# Altium project PT-15-V1.0.PrjPcb (part 4 of 7)

## Sheet 06-RTL8111H-1.schdoc
size A2
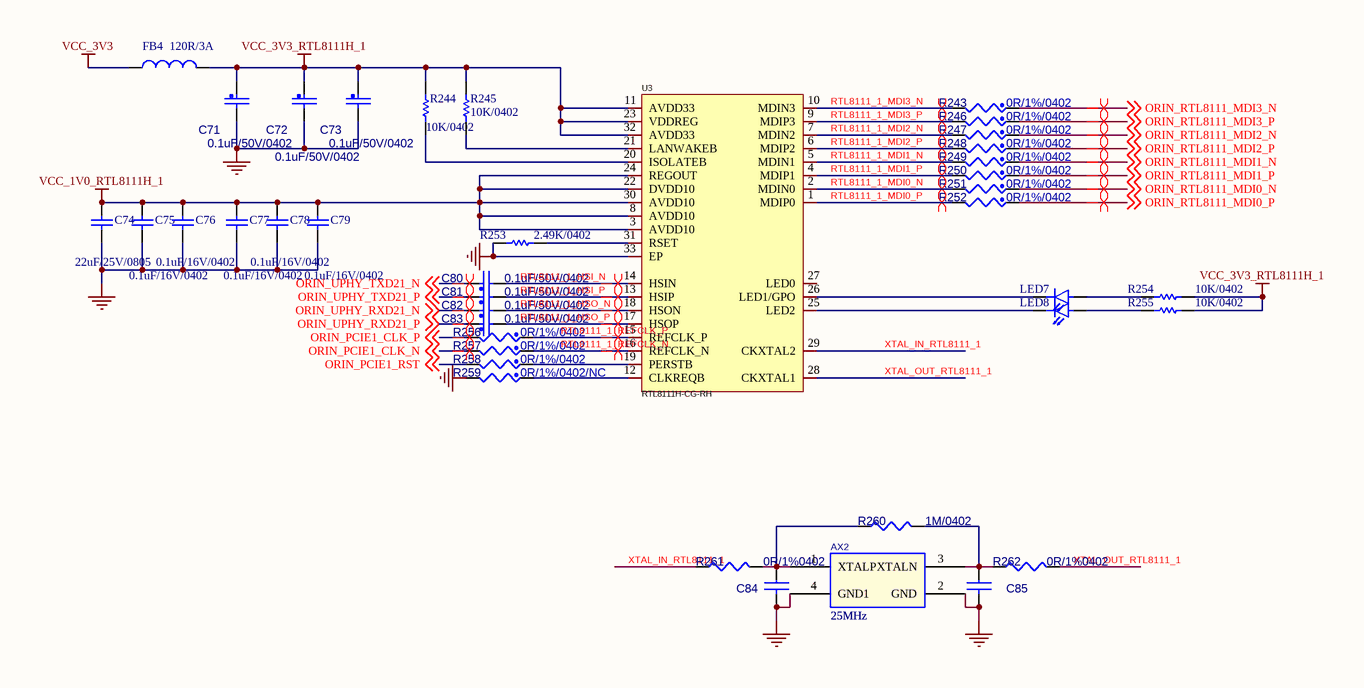
[diagram p9: 06-RTL8111H-1.schdoc]

### Parts
AX2  25MHz  [2016]
C71  value 0.1uF/50V/0402  [C0402]  (hidden comment: CAP_NP)
C72  value 0.1uF/50V/0402  [C0402]  (hidden comment: CAP_NP)
C73  value 0.1uF/50V/0402  [C0402]  (hidden comment: CAP_NP)
C74  22uF/25V/0805  [C0805]
C75  0.1uF/16V/0402  [C0402]
C76  0.1uF/16V/0402  [C0402]
C77  0.1uF/16V/0402  [C0402]
C78  0.1uF/16V/0402  [C0402]
C79  0.1uF/16V/0402  [C0402]
C80  value 0.1uF/50V/0402  [C0402]  (hidden comment: CAP_NP)
C81  value 0.1uF/50V/0402  [C0402]  (hidden comment: CAP_NP)
C82  value 0.1uF/50V/0402  [C0402]  (hidden comment: CAP_NP)
C83  value 0.1uF/50V/0402  [C0402]  (hidden comment: CAP_NP)
C84  CAP NP_Dup3  [C0402]  (value not drawn)
C85  CAP NP_Dup3  [C0402]  (value not drawn)
FB4  120R/3A  [L0603]
LED7  LED_GREEN  [LED0603]  (value not drawn)
LED8  LED_GREEN  [LED0603]  (value not drawn)
R243  value 0R/1%/0402  [R0402]  (hidden comment: RES_Dup2)
R244  10K/0402  [R0402]
R245  10K/0402  [R0402]
R246  value 0R/1%/0402  [R0402]  (hidden comment: RES_Dup2)
R247  value 0R/1%/0402  [R0402]  (hidden comment: RES_Dup2)
R248  value 0R/1%/0402  [R0402]  (hidden comment: RES_Dup2)
R249  value 0R/1%/0402  [R0402]  (hidden comment: RES_Dup2)
R250  value 0R/1%/0402  [R0402]  (hidden comment: RES_Dup2)
R251  value 0R/1%/0402  [R0402]  (hidden comment: RES_Dup2)
R252  value 0R/1%/0402  [R0402]  (hidden comment: RES_Dup2)
R253  2.49K/0402  [R0402]
R254  10K/0402  [R0402]
R255  10K/0402  [R0402]
R256  value 0R/1%/0402  [R0402]  (hidden comment: RES_Dup2)
R257  value 0R/1%/0402  [R0402]  (hidden comment: RES_Dup2)
R258  value 0R/1%/0402  [R0402]  (hidden comment: RES_Dup2)
R259  value 0R/1%/0402/NC  [R0402]  (hidden comment: RES_Dup2)
R260  value 1M/0402  [R0402]  (hidden comment: R_Dup3)
R261  value 0R/1%0402  [R0402]  (hidden comment: R_Dup3)
R262  value 0R/1%0402  [R0402]  (hidden comment: R_Dup3)
U3  RTL8111H-CG-RH  [RTL8111H-CG-RH]

### Nets
GND: AX2.2(GND) AX2.4(GND1) C71.2 C72.2 C73.2 C74.1 C75.1 C76.1 C77.1 C78.1 C79.1 C84.2 C85.2 R253.1 R259.2 U3.33(EP)
VCC_1V0_RTL8111H_1: C74.2 C75.2 C76.2 C77.2 C78.2 C79.2 U3.3(AVDD10) U3.8(AVDD10) U3.22(DVDD10) U3.24(REGOUT) U3.30(AVDD10)
VCC_3V3: FB4.1  [project net 3V3_ORIN_F1]
VCC_3V3_RTL8111H_1: C71.1 C72.1 C73.1 FB4.2 R244.1 R245.1 R254.1 R255.1 U3.11(AVDD33) U3.23(VDDREG) U3.32(AVDD33)
ORIN_PCIE1_CLK_N: R257.2 ; off-sheet ORIN_PCIE1_CLK_N  [project net DP1_TXD2_N]
ORIN_PCIE1_CLK_P: R256.2 ; off-sheet ORIN_PCIE1_CLK_P  [project net DP1_TXD2_P]
ORIN_PCIE1_RST: R258.2 ; off-sheet ORIN_PCIE1_RST  [project net SNN_NVHS_SLVS_RX5_N]
ORIN_RTL8111_MDI0_N: R251.1 ; off-sheet ORIN_RTL8111_MDI0_N
ORIN_RTL8111_MDI0_P: R252.1 ; off-sheet ORIN_RTL8111_MDI0_P
ORIN_RTL8111_MDI1_N: R249.1 ; off-sheet ORIN_RTL8111_MDI1_N
ORIN_RTL8111_MDI1_P: R250.1 ; off-sheet ORIN_RTL8111_MDI1_P
ORIN_RTL8111_MDI2_N: R247.1 ; off-sheet ORIN_RTL8111_MDI2_N
ORIN_RTL8111_MDI2_P: R248.1 ; off-sheet ORIN_RTL8111_MDI2_P
ORIN_RTL8111_MDI3_N: R243.1 ; off-sheet ORIN_RTL8111_MDI3_N
ORIN_RTL8111_MDI3_P: R246.1 ; off-sheet ORIN_RTL8111_MDI3_P
ORIN_UPHY_RXD21_N: C82.1 ; off-sheet ORIN_UPHY_RXD21_N  [project net SNN_NVHS_SLVS_RX1_N]
ORIN_UPHY_RXD21_P: C83.1 ; off-sheet ORIN_UPHY_RXD21_P  [project net SNN_NVHS_SLVS_RX1_P]
ORIN_UPHY_TXD21_N: C80.1 ; off-sheet ORIN_UPHY_TXD21_N  [project net SNN_NVHS1_TX1_N]
ORIN_UPHY_TXD21_P: C81.1 ; off-sheet ORIN_UPHY_TXD21_P  [project net SNN_NVHS1_TX1_P]
RTL8111_1_HSI_N: C80.2 U3.14(HSIN)
RTL8111_1_HSI_P: C81.2 U3.13(HSIP)
RTL8111_1_HSO_N: C82.2 U3.18(HSON)
RTL8111_1_HSO_P: C83.2 U3.17(HSOP)
RTL8111_1_MDI0_N: R251.2 U3.2(MDIN0)
RTL8111_1_MDI0_P: R252.2 U3.1(MDIP0)
RTL8111_1_MDI1_N: R249.2 U3.5(MDIN1)
RTL8111_1_MDI1_P: R250.2 U3.4(MDIP1)
RTL8111_1_MDI2_N: R247.2 U3.7(MDIN2)
RTL8111_1_MDI2_P: R248.2 U3.6(MDIP2)
RTL8111_1_MDI3_N: R243.2 U3.10(MDIN3)
RTL8111_1_MDI3_P: R246.2 U3.9(MDIP3)
RTL8111_1_REFCLK_N: R257.1 U3.16(REFCLK_N)
RTL8111_1_REFCLK_P: R256.1 U3.15(REFCLK_P)
XTAL_IN_RTL8111_1: R261.1 U3.29(CKXTAL2)
XTAL_OUT_RTL8111_1: R262.2 U3.28(CKXTAL1)
NetAX2_1: AX2.1(XTALP) C84.1 R260.1 R261.2
NetAX2_3: AX2.3(XTALN) C85.1 R260.2 R262.1
NetLED7_1: LED7.1 R254.2
NetLED7_2: LED7.2 U3.26(LED1/GPO)
NetLED8_1: LED8.1 R255.2
NetLED8_2: LED8.2 U3.25(LED2)
NetR244_2: R244.2 U3.20(ISOLATEB)
NetR245_2: R245.2 U3.21(LANWAKEB)
NetR253_2: R253.2 U3.31(RSET)
NetR258_1: R258.1 U3.19(PERSTB)
NetR259_1: R259.1 U3.12(CLKREQB)

Not connected (* = marked no-connect by the designer): U3 27(LED0)

### Layout directives
differential pair: DP1_TXD2_N, DP1_TXD2_P, ORIN_RTL8111_MDI0_N, ORIN_RTL8111_MDI0_P, ORIN_RTL8111_MDI1_N, ORIN_RTL8111_MDI1_P, ORIN_RTL8111_MDI2_N, ORIN_RTL8111_MDI2_P, ORIN_RTL8111_MDI3_N, ORIN_RTL8111_MDI3_P, RTL8111_1_HSI_N, RTL8111_1_HSI_P, RTL8111_1_HSO_N, RTL8111_1_HSO_P, RTL8111_1_MDI0_N, RTL8111_1_MDI0_P, RTL8111_1_MDI1_N, RTL8111_1_MDI1_P, RTL8111_1_MDI2_N, RTL8111_1_MDI2_P, RTL8111_1_MDI3_N, RTL8111_1_MDI3_P, RTL8111_1_REFCLK_N, RTL8111_1_REFCLK_P, SNN_NVHS1_TX1_N, SNN_NVHS1_TX1_P, SNN_NVHS_SLVS_RX1_N, SNN_NVHS_SLVS_RX1_P

### Library data of the parts
AX2 = XTAL_0: as AX1 on sheet 05_RTL8211F; Value: 25MHz
C71-C73 C80-C83 = CAP_NP: GCM155R71H104KE02/MURATA; Part Reference: C15; CLASS: DISCRETE; FPLIST: CC0402_25,CC0402_HD,CC0402_CC; CAD_APPROVED: Yes; MFG_PN01: 0402YC104KAT2A; MFG_NAME01: AVX; Tolerance: 10%; AGILE_PN: 150-75182; VOLTAGE: 16V; HEIGHT: 0.635MM; ROHS: Yes; TOL: 10%; PCB Footprint: C0402
C74-C79 = CAP: Capacitor; Value: 100pF; Published: 8-Jun-2000; Revision: July-2002: Re-released for DXP Platform.; Publisher: Altium Limited
C84 = CAP NP_Dup3: Part Reference: C71; Value: 20pF/50V X7R; PCB Footprint: C0402
C85 = CAP NP_Dup3: Part Reference: C72; Value: 20pF/50V X7R; PCB Footprint: C0402
FB4 = Inductor: BLM18KG121TN1D; Code_IEC: 1005; Value: 10mH; Published: 8-Jun-2000; LatestRevisionDate: 29-May-2009; LatestRevisionNote: IPC-7351 Footprint Added.; PackageReference: 0402-A; Publisher: Altium Limited; PackageDescription: Chip Inductor; Code_JEITA: 0402
LED7 LED8 = LED
R243 R256 = RES_Dup2: as R207 on sheet 05_RTL8211F; ROHS: Yes; HEIGHT: 0.4MM; PCB Footprint: R0402
R244 R245 R253 = Res Semi: Semiconductor Resistor; Value: 240R; Published: 8-Jun-2000; LatestRevisionDate: 17-Jul-2002; LatestRevisionNote: Re-released for DXP Platform.; PackageReference: AXIAL-0.5; Publisher: Altium Limited; PackageDescription: Axial Device, Thru-Hole; 2 Leads; 0.5 in Pin Spacing
R246 R257-R259 = RES_Dup2: as R208 on sheet 05_RTL8211F; HEIGHT: 0.4MM; ROHS: Yes; PCB Footprint: R0402
R247 = RES_Dup2: AC0402FR-070RL/YAGEO; Part Reference: R99; CLASS: DISCRETE; TOL: 5%; AGILE_PN: 470-75790; Tolerance: 1%; MFG_NAME01: YAGEO; MFG_PN01: CR-02FL6---33R; CAD_APPROVED: Yes; FPLIST: RC0603_OV; SIGNAL_MODEL: DEFAULT_RESISTOR_33.000000OHM_2_1; HEIGHT: 0.4MM; ROHS: Yes; PCB Footprint: R0402
R248 = RES_Dup2: AC0402FR-070RL/YAGEO; Part Reference: R101; CLASS: DISCRETE; TOL: 5%; AGILE_PN: 470-75790; Tolerance: 1%; MFG_NAME01: YAGEO; MFG_PN01: CR-02FL6---33R; CAD_APPROVED: Yes; FPLIST: RC0603_OV; SIGNAL_MODEL: DEFAULT_RESISTOR_33.000000OHM_2_1; HEIGHT: 0.4MM; ROHS: Yes; PCB Footprint: R0402
R249 = RES_Dup2: AC0402FR-070RL/YAGEO; Part Reference: R102; CLASS: DISCRETE; TOL: 5%; AGILE_PN: 470-75790; Tolerance: 1%; MFG_NAME01: YAGEO; MFG_PN01: CR-02FL6---33R; CAD_APPROVED: Yes; FPLIST: RC0603_OV; SIGNAL_MODEL: DEFAULT_RESISTOR_33.000000OHM_2_1; HEIGHT: 0.4MM; ROHS: Yes; PCB Footprint: R0402
R250 = RES_Dup2: AC0402FR-070RL/YAGEO; Part Reference: R103; CLASS: DISCRETE; TOL: 5%; AGILE_PN: 470-75790; Tolerance: 1%; MFG_NAME01: YAGEO; MFG_PN01: CR-02FL6---33R; CAD_APPROVED: Yes; FPLIST: RC0603_OV; SIGNAL_MODEL: DEFAULT_RESISTOR_33.000000OHM_2_1; HEIGHT: 0.4MM; ROHS: Yes; PCB Footprint: R0402
R251 = RES_Dup2: AC0402FR-070RL/YAGEO; Part Reference: R104; CLASS: DISCRETE; TOL: 5%; AGILE_PN: 470-75790; Tolerance: 1%; MFG_NAME01: YAGEO; MFG_PN01: CR-02FL6---33R; CAD_APPROVED: Yes; FPLIST: RC0603_OV; SIGNAL_MODEL: DEFAULT_RESISTOR_33.000000OHM_2_1; HEIGHT: 0.4MM; ROHS: Yes; PCB Footprint: R0402
R252 = RES_Dup2: AC0402FR-070RL/YAGEO; Part Reference: R105; CLASS: DISCRETE; TOL: 5%; AGILE_PN: 470-75790; Tolerance: 1%; MFG_NAME01: YAGEO; MFG_PN01: CR-02FL6---33R; CAD_APPROVED: Yes; FPLIST: RC0603_OV; SIGNAL_MODEL: DEFAULT_RESISTOR_33.000000OHM_2_1; HEIGHT: 0.4MM; ROHS: Yes; PCB Footprint: R0402
R254 R255 = Res Semi: Semiconductor Resistor; Value: 1K; Published: 8-Jun-2000; LatestRevisionDate: 17-Jul-2002; LatestRevisionNote: Re-released for DXP Platform.; PackageReference: AXIAL-0.5; Publisher: Altium Limited; PackageDescription: Axial Device, Thru-Hole; 2 Leads; 0.5 in Pin Spacing
R260 R261 = R_Dup3: Part Reference: R130; PCB Footprint: R0402
R262 = R_Dup3: Part Reference: R131; PCB Footprint: R0402
U3 = RTL8111H-CG: Manufacturer: REALTEK(瑞昱); Add into BOM: yes; Symbol: RTL8111H-CG; Device: RTL8111H-CG; LCSC Part Name: RTL8111H-CG; Supplier Part: C2761340; Manufacturer Part: RTL8111H-CG; Supplier Footprint: QFN-32-EP(4x4); JLCPCB Part Class: Extended Part; Datasheet: https://atta.szlcsc.com/upload/public/pdf/source/20210810/FF05C5D46F518898BC2EC053E52D54B5.pdf; Supplier: LCSC; Convert to PCB: yes; Comment_1: RTL8111H-CG

## Sheet 07-N100.SchDoc: KARGOBOT-TBOX-V2.0
size 513 x 386 mm; Page Create Date: March  8, 1995; Page Number: 4; Page Size: C; Page Count: 81; RevCode: A; DsnPath: C:\Users\Administrator\Desktop\123\KARGOBOT-TCU-ORIN-V1.1.DSN; SchematicName: KARGOBT-TCU-ORIN-V1.1; PageName: N100; PageSize: C; TopSchematic: True
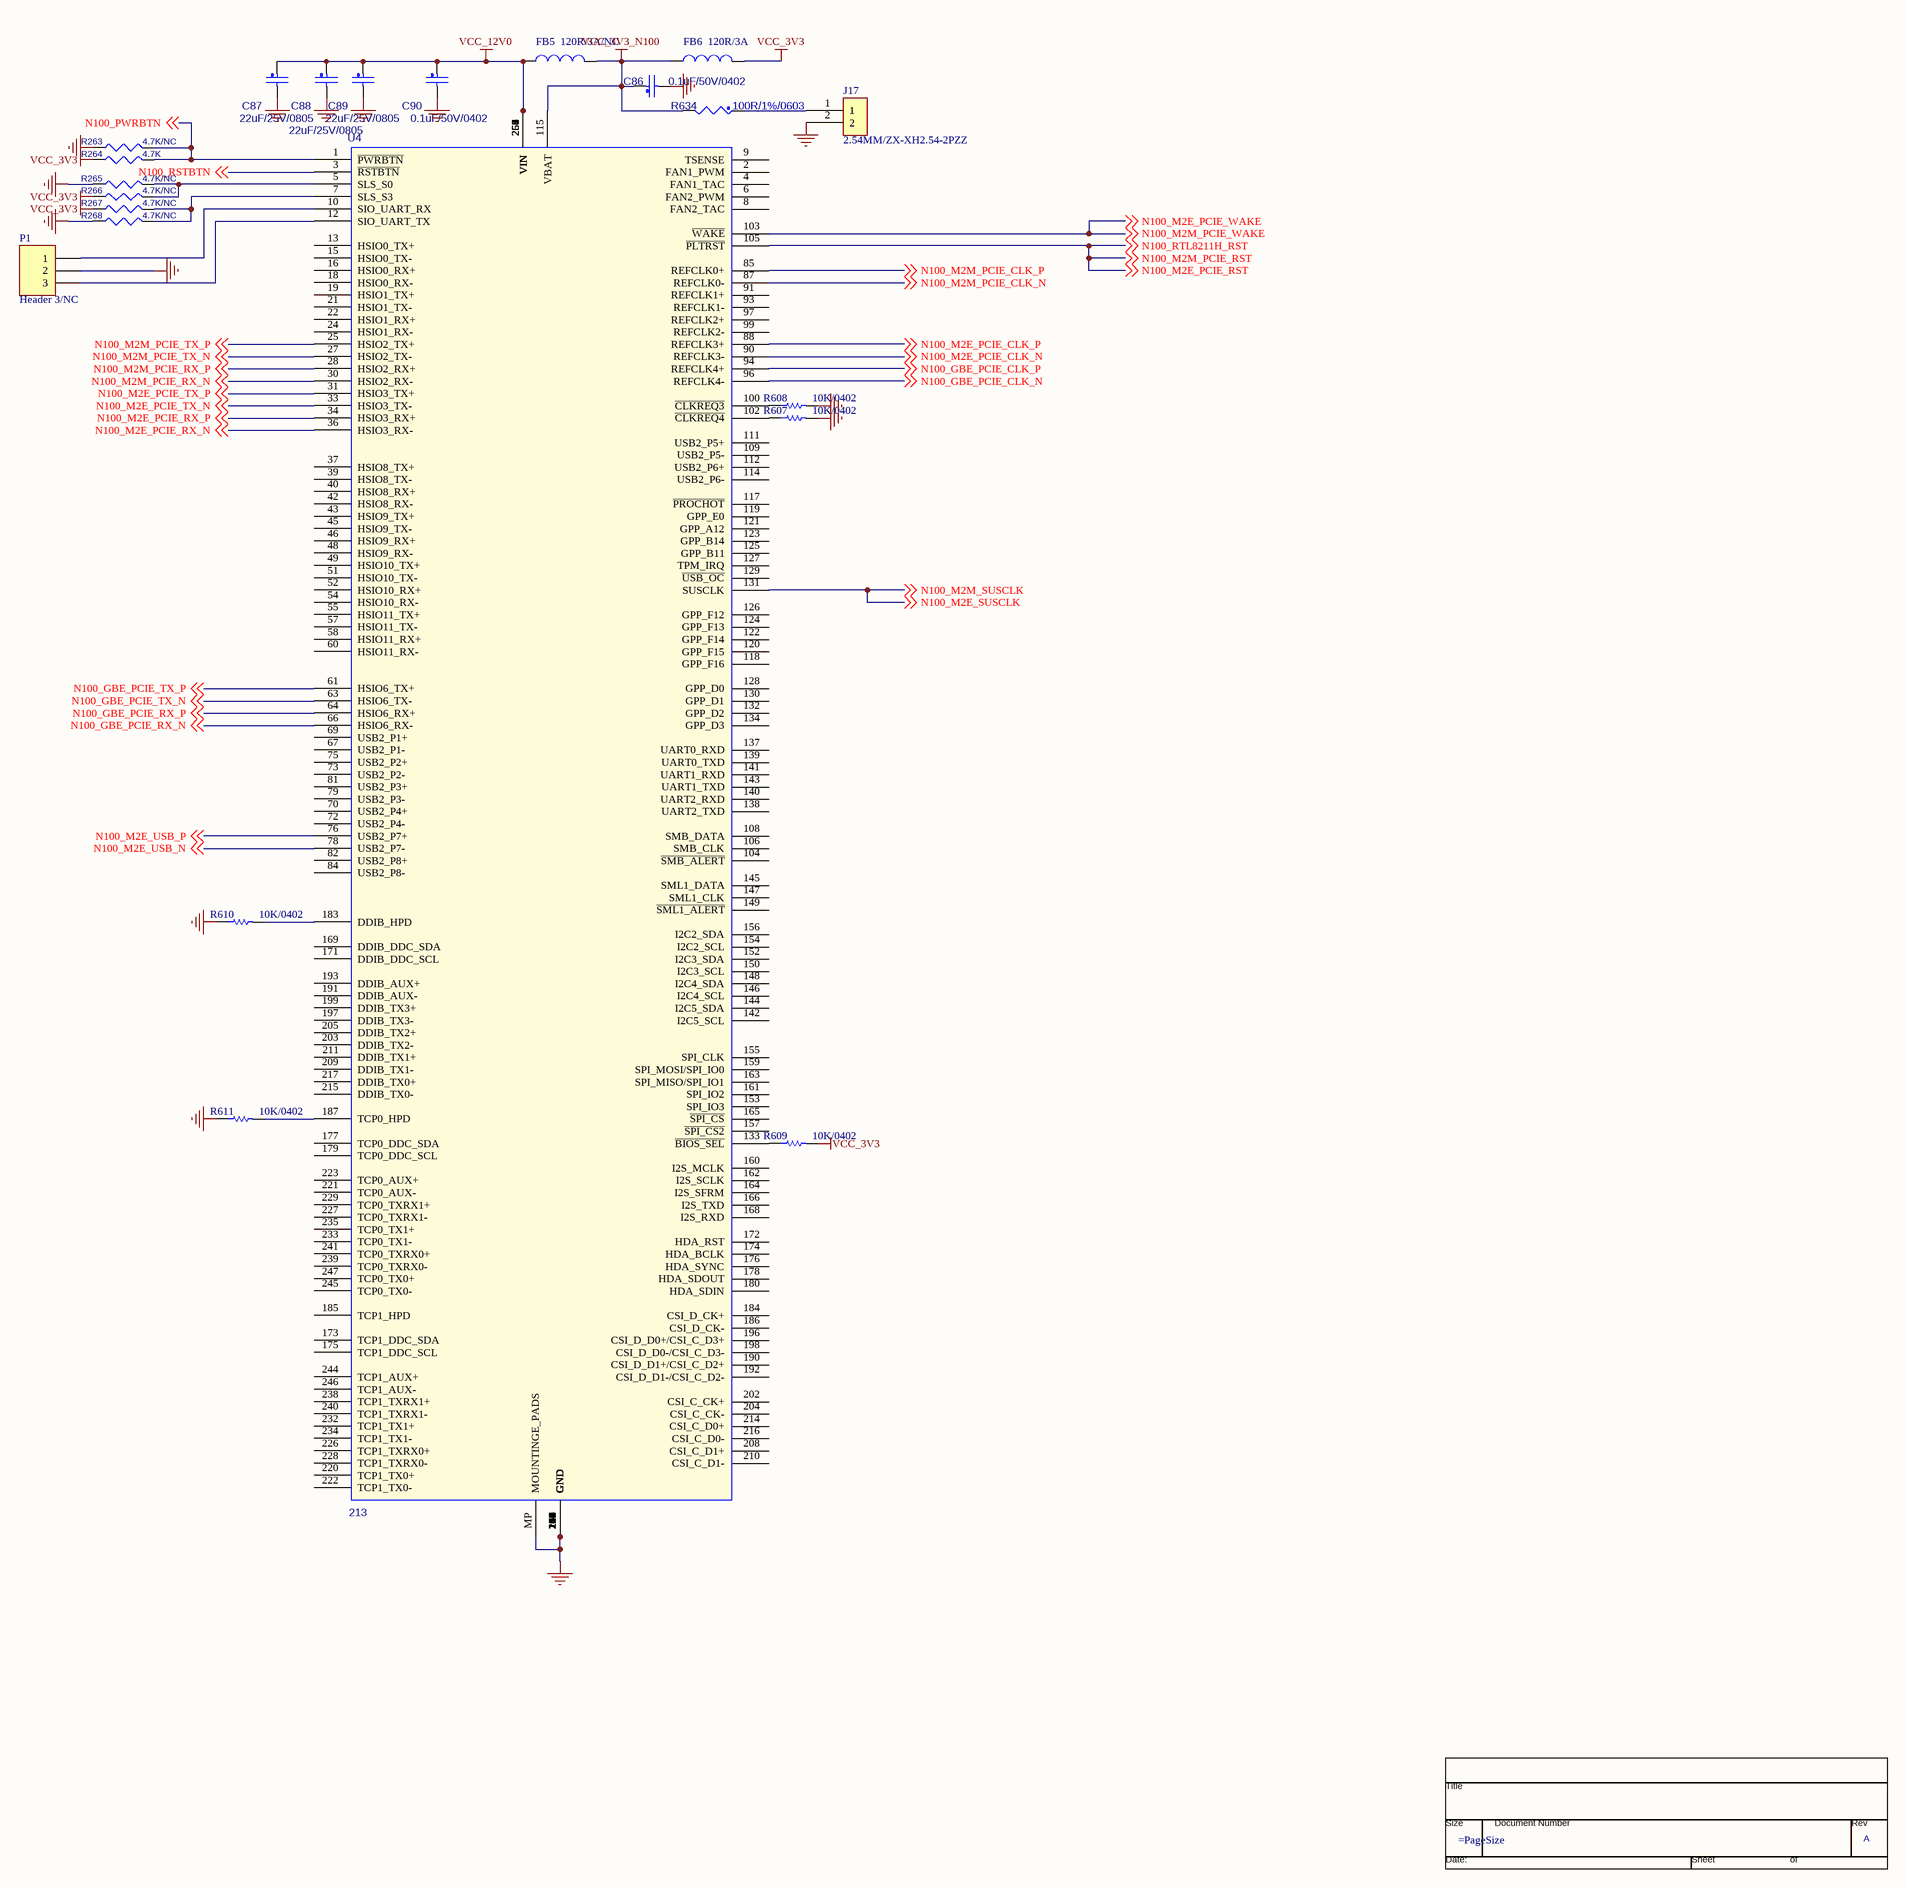
[diagram p10: 07-N100.SchDoc]

### Parts
(Parts that share a designator on the sheet are numbered #1, #2 ... from top to bottom, then left to right.)
*#6  RevCode: A  (graphical)
C86  value 0.1uF/50V/0402  [C0402]  (hidden comment: CAP_NP)
C87  value 22uF/25V/0805  [C0805]  (hidden comment: CAP_NP)
C88  value 22uF/25V/0805  [C0805]  (hidden comment: CAP_NP)
C89  value 22uF/25V/0805  [C0805]  (hidden comment: CAP_NP)
C90  value 0.1uF/50V/0402  [C0402]  (hidden comment: CAP_NP)
FB5  120R/3A/NC  [L0603]
FB6  120R/3A  [L0603]
J17  2.54MM/ZX-XH2.54-2PZZ  [CONN-TH_2P-P2.50_HX25003-2A]
P1  Header 3/NC  [HEADER3]
R263  value 4.7K/NC  [R0402]  (hidden comment: RESISTOR)
R264  value 4.7K  [R0402]  (hidden comment: RESISTOR)
R265  value 4.7K/NC  [R0402]  (hidden comment: RESISTOR)
R266  value 4.7K/NC  [R0402]  (hidden comment: RESISTOR)
R267  value 4.7K/NC  [R0402]  (hidden comment: RESISTOR)
R268  value 4.7K/NC  [R0402]  (hidden comment: RESISTOR)
R607  10K/0402  [R0402]
R608  10K/0402  [R0402]
R609  10K/0402  [R0402]
R610  10K/0402  [R0402]
R611  10K/0402  [R0402]
R634  value 100R/1%/0603  [R0603]  (hidden comment: RES_Dup2)
U4  value 213  [N100]  (hidden comment: N100)

### Nets
GND: C86.2 C87.2 C88.2 C89.2 C90.2 J17.2 P1.2 R263.1 R265.1 R268.1 R607.2 R608.2 R610.1 R611.1 U4.11(GND) U4.14(GND) U4.17(GND) U4.20(GND) U4.23(GND) U4.26(GND) U4.29(GND) U4.32(GND) U4.35(GND) U4.38(GND) U4.41(GND) U4.44(GND) U4.47(GND) U4.50(GND) U4.53(GND) U4.56(GND) U4.59(GND) U4.62(GND) U4.65(GND) U4.68(GND) U4.71(GND) U4.74(GND) U4.77(GND) U4.80(GND) U4.83(GND) U4.86(GND) U4.89(GND) U4.92(GND) U4.95(GND) U4.98(GND) U4.101(GND) U4.107(GND) U4.110(GND) U4.113(GND) U4.116(GND) U4.135(GND) U4.136(GND) U4.151(GND) U4.158(GND) U4.167(GND) U4.170(GND) U4.181(GND) U4.182(GND) U4.188(GND) U4.189(GND) U4.194(GND) U4.195(GND) U4.200(GND) U4.201(GND) U4.206(GND) U4.207(GND) U4.212(GND) U4.213(GND) U4.218(GND) U4.219(GND) U4.224(GND) U4.225(GND) U4.230(GND) U4.231(GND) U4.236(GND) U4.237(GND) U4.242(GND) U4.243(GND) U4.248(GND) U4.249(GND) U4.MP(MOUNTINGE_PADS)
VCC_3V3: FB6.2 R264.1 R266.1 R267.1 R609.2  [project net 3V3_ORIN_F1]
VCC_3V3_N100: C86.1 FB5.2 FB6.1 R634.2 U4.115(VBAT)
VCC_12V0: C87.1 C88.1 C89.1 C90.1 FB5.1 U4.250(VIN) U4.251(VIN) U4.252(VIN) U4.253(VIN) U4.254(VIN) U4.255(VIN) U4.256(VIN) U4.257(VIN) U4.258(VIN) U4.259(VIN) U4.260(VIN)
N100_GBE_PCIE_CLK_N: U4.96(REFCLK4-) ; off-sheet N100_GBE_PCIE_CLK_N
N100_GBE_PCIE_CLK_P: U4.94(REFCLK4+) ; off-sheet N100_GBE_PCIE_CLK_P
N100_GBE_PCIE_RX_N: U4.66(HSIO6_RX-) ; off-sheet N100_GBE_PCIE_RX_N
N100_GBE_PCIE_RX_P: U4.64(HSIO6_RX+) ; off-sheet N100_GBE_PCIE_RX_P
N100_GBE_PCIE_TX_N: U4.63(HSIO6_TX-) ; off-sheet N100_GBE_PCIE_TX_N
N100_GBE_PCIE_TX_P: U4.61(HSIO6_TX+) ; off-sheet N100_GBE_PCIE_TX_P
N100_M2E_PCIE_CLK_N: U4.90(REFCLK3-) ; off-sheet N100_M2E_PCIE_CLK_N
N100_M2E_PCIE_CLK_P: U4.88(REFCLK3+) ; off-sheet N100_M2E_PCIE_CLK_P
N100_M2E_PCIE_RST: U4.105(~{PLTRST}) ; off-sheet N100_RTL8211H_RST, off-sheet N100_M2M_PCIE_RST, off-sheet N100_M2E_PCIE_RST  [also labelled N100_M2M_PCIE_RST, N100_RTL8211H_RST]
N100_M2E_PCIE_RX_N: U4.36(HSIO3_RX-) ; off-sheet N100_M2E_PCIE_RX_N
N100_M2E_PCIE_RX_P: U4.34(HSIO3_RX+) ; off-sheet N100_M2E_PCIE_RX_P
N100_M2E_PCIE_TX_N: U4.33(HSIO3_TX-) ; off-sheet N100_M2E_PCIE_TX_N
N100_M2E_PCIE_TX_P: U4.31(HSIO3_TX+) ; off-sheet N100_M2E_PCIE_TX_P
N100_M2E_PCIE_WAKE: U4.103(~{WAKE}) ; off-sheet N100_M2M_PCIE_WAKE, off-sheet N100_M2E_PCIE_WAKE  [also labelled N100_M2M_PCIE_WAKE]
N100_M2E_SUSCLK: U4.131(SUSCLK) ; off-sheet N100_M2M_SUSCLK, off-sheet N100_M2E_SUSCLK  [also labelled N100_M2M_SUSCLK]
N100_M2E_USB_N: U4.78(USB2_P7-) ; off-sheet N100_M2E_USB_N
N100_M2E_USB_P: U4.76(USB2_P7+) ; off-sheet N100_M2E_USB_P
N100_M2M_PCIE_CLK_N: U4.87(REFCLK0-) ; off-sheet N100_M2M_PCIE_CLK_N
N100_M2M_PCIE_CLK_P: U4.85(REFCLK0+) ; off-sheet N100_M2M_PCIE_CLK_P
N100_M2M_PCIE_RX_N: U4.30(HSIO2_RX-) ; off-sheet N100_M2M_PCIE_RX_N
N100_M2M_PCIE_RX_P: U4.28(HSIO2_RX+) ; off-sheet N100_M2M_PCIE_RX_P
N100_M2M_PCIE_TX_N: U4.27(HSIO2_TX-) ; off-sheet N100_M2M_PCIE_TX_N
N100_M2M_PCIE_TX_P: U4.25(HSIO2_TX+) ; off-sheet N100_M2M_PCIE_TX_P
N100_PWRBTN: R263.2 R264.2 U4.1(~{PWRBTN}) ; off-sheet N100_PWRBTN
N100_RSTBTN: U4.3(~{RSTBTN}) ; off-sheet N100_RSTBTN
NetJ17_1: J17.1 R634.1
NetP1_1: P1.1 U4.10(SIO_UART_RX)
NetP1_3: P1.3 U4.12(SIO_UART_TX)
NetR265_2: R265.2 R266.2 U4.5(SLS_S0)
NetR267_2: R267.2 R268.2 U4.7(SLS_S3)
NetR607_1: R607.1 U4.102(~{CLKREQ4})
NetR608_1: R608.1 U4.100(~{CLKREQ3})
NetR609_1: R609.1 U4.133(~{BIOS_SEL})
NetR610_2: R610.2 U4.183(DDIB_HPD)
NetR611_2: R611.2 U4.187(TCP0_HPD)

Not connected (* = marked no-connect by the designer): U4 2(FAN1_PWM) 4(FAN1_TAC) 6(FAN2_PWM) 8(FAN2_TAC) 9(TSENSE) 13(HSIO0_TX+) 15(HSIO0_TX-) 16(HSIO0_RX+) 18(HSIO0_RX-) 19(HSIO1_TX+) 21(HSIO1_TX-) 22(HSIO1_RX+) 24(HSIO1_RX-) 37(HSIO8_TX+) 39(HSIO8_TX-) 40(HSIO8_RX+) 42(HSIO8_RX-) 43(HSIO9_TX+) 45(HSIO9_TX-) 46(HSIO9_RX+) 48(HSIO9_RX-) 49(HSIO10_TX+) 51(HSIO10_TX-) 52(HSIO10_RX+) 54(HSIO10_RX-) 55(HSIO11_TX+) 57(HSIO11_TX-) 58(HSIO11_RX+) 60(HSIO11_RX-) 67(USB2_P1-) 69(USB2_P1+) 70(USB2_P4+) 72(USB2_P4-) 73(USB2_P2-) 75(USB2_P2+) 79(USB2_P3-) 81(USB2_P3+) 82(USB2_P8+) 84(USB2_P8-) 91(REFCLK1+) 93(REFCLK1-) 97(REFCLK2+) 99(REFCLK2-) 104(~{SMB_ALERT}) 106(SMB_CLK) 108(SMB_DATA) 109(USB2_P5-) 111(USB2_P5+) 112(USB2_P6+) 114(USB2_P6-) 117(~{PROCHOT}) 118(GPP_F16) 119(GPP_E0) 120(GPP_F15) 121(GPP_A12) 122(GPP_F14) 123(GPP_B14) 124(GPP_F13) 125(GPP_B11) 126(GPP_F12) 127(TPM_IRQ) 128(GPP_D0) 129(~{USB_OC}) 130(GPP_D1) 132(GPP_D2) 134(GPP_D3) 137(UART0_RXD) 138(UART2_TXD) 139(UART0_TXD) 140(UART2_RXD) 141(UART1_RXD) 142(I2C5_SCL) 143(UART1_TXD) 144(I2C5_SDA) 145(SML1_DATA) 146(I2C4_SCL) 147(SML1_CLK) 148(I2C4_SDA) 149(~{SML1_ALERT}) 150(I2C3_SCL) 152(I2C3_SDA) 153(SPI_IO3) 154(I2C2_SCL) 155(SPI_CLK) 156(I2C2_SDA) 157(~{SPI_CS2}) 159(SPI_MOSI/SPI_IO0) 160(I2S_MCLK) 161(SPI_IO2) 162(I2S_SCLK) 163(SPI_MISO/SPI_IO1) 164(I2S_SFRM) 165(~{SPI_CS}) 166(I2S_TXD) 168(I2S_RXD) 169(DDIB_DDC_SDA) 171(DDIB_DDC_SCL) 172(HDA_RST) 173(TCP1_DDC_SDA) 174(HDA_BCLK) 175(TCP1_DDC_SCL) 176(HDA_SYNC) 177(TCP0_DDC_SDA) 178(HDA_SDOUT) 179(TCP0_DDC_SCL) 180(HDA_SDIN) 184(CSI_D_CK+) 185(TCP1_HPD) 186(CSI_D_CK-) 190(CSI_D_D1+/CSI_C_D2+) 191(DDIB_AUX-) 192(CSI_D_D1-/CSI_C_D2-) 193(DDIB_AUX+) 196(CSI_D_D0+/CSI_C_D3+) 197(DDIB_TX3-) 198(CSI_D_D0-/CSI_C_D3-) 199(DDIB_TX3+) 202(CSI_C_CK+) 203(DDIB_TX2-) 204(CSI_C_CK-) 205(DDIB_TX2+) 208(CSI_C_D1+) 209(DDIB_TX1-) 210(CSI_C_D1-) 211(DDIB_TX1+) 214(CSI_C_D0+) 215(DDIB_TX0-) 216(CSI_C_D0-) 217(DDIB_TX0+) 220(TCP1_TX0+) 221(TCP0_AUX-) 222(TCP1_TX0-) 223(TCP0_AUX+) 226(TCP1_TXRX0+) 227(TCP0_TXRX1-) 228(TCP1_TXRX0-) 229(TCP0_TXRX1+) 232(TCP1_TX1+) 233(TCP0_TX1-) 234(TCP1_TX1-) 235(TCP0_TX1+) 238(TCP1_TXRX1+) 239(TCP0_TXRX0-) 240(TCP1_TXRX1-) 241(TCP0_TXRX0+) 244(TCP1_AUX+) 245(TCP0_TX0-) 246(TCP1_AUX-) 247(TCP0_TX0+)

### Notes on the sheet
- (in symbol TitleBlock0) Title; Size; Document Number; Rev; Date:; Sheet; of

### Library data of the parts
*#6 = TitleBlock0: Page Count: 81; Page Number: 4; Title: KARGOBOT-TBOX-V2.0; Page Size: =PageSize; Page Create Date: March  8, 1995; Page Modify Date: =ModifiedDate
C86 C90 = CAP_NP: as C71-C73 on sheet 06-RTL8111H-1; HEIGHT: 0.635MM; ROHS: Yes; TOL: 10%; PCB Footprint: C0402
C87-C89 = CAP_NP: GRT31CC71E226ME13/MURATA; Part Reference: C13; CLASS: DISCRETE; VOLTAGE: 10v; CAD_APPROVED: Yes; MFG_PN01: C1608X5R1A106K; MFG_NAME01: TDK; TOL: 10%; AGILE_PN: 150-78675; FPLIST: CC0603_OV,CC0603,0603_CC; PCB Footprint: C1206; HEIGHT: 1.016MM; ROHS: Yes; Tolerance: 10%
FB5 FB6 = Inductor: as FB4 on sheet 06-RTL8111H-1; Published: 8-Jun-2000; LatestRevisionDate: 29-May-2009; LatestRevisionNote: IPC-7351 Footprint Added.; PackageReference: 0402-A; Publisher: Altium Limited; PackageDescription: Chip Inductor; Code_JEITA: 0402
J17 = header2
P1 = Header 3: Header, 3-Pin; LatestRevisionDate: 17-Jul-2002; LatestRevisionNote: Re-released for DXP Platform.; Publisher: Altium Limited
R263-R268 = RESISTOR: Part Reference: R123; PCB Footprint: R0402
R607-R611 = Res Semi: Semiconductor Resistor; Value: 240R; Published: 8-Jun-2000; LatestRevisionDate: 17-Jul-2002; LatestRevisionNote: Re-released for DXP Platform.; PackageReference: AXIAL-0.5; Publisher: Altium Limited; PackageDescription: Axial Device, Thru-Hole; 2 Leads; 0.5 in Pin Spacing
R634 = RES_Dup2: AC0402FR-070RL/YAGEO; Part Reference: R97; CLASS: DISCRETE; SIGNAL_MODEL: DEFAULT_RESISTOR_33.000000OHM_2_1; FPLIST: RC0603_OV; CAD_APPROVED: Yes; MFG_PN01: CR-02FL6---33R; MFG_NAME01: YAGEO; Tolerance: 1%; AGILE_PN: 470-75790; TOL: 5%; PCB Footprint: R0402; ROHS: Yes; HEIGHT: 0.4MM
U4 = N100: Part Reference: U7

## Sheet 08-M2_E&M_KEY.SchDoc: KARGOBOT-TBOX-V2.0
size 513 x 386 mm; Page Create Date: March  8, 1995; Page Number: 4; Page Size: C; Page Count: 81; RevCode: A; DsnPath: C:\Users\Administrator\Desktop\123\KARGOBOT-TCU-ORIN-V1.1.DSN; SchematicName: KARGOBT-TCU-ORIN-V1.1; PageName: M2_E&M_KEY; PageSize: C; TopSchematic: True
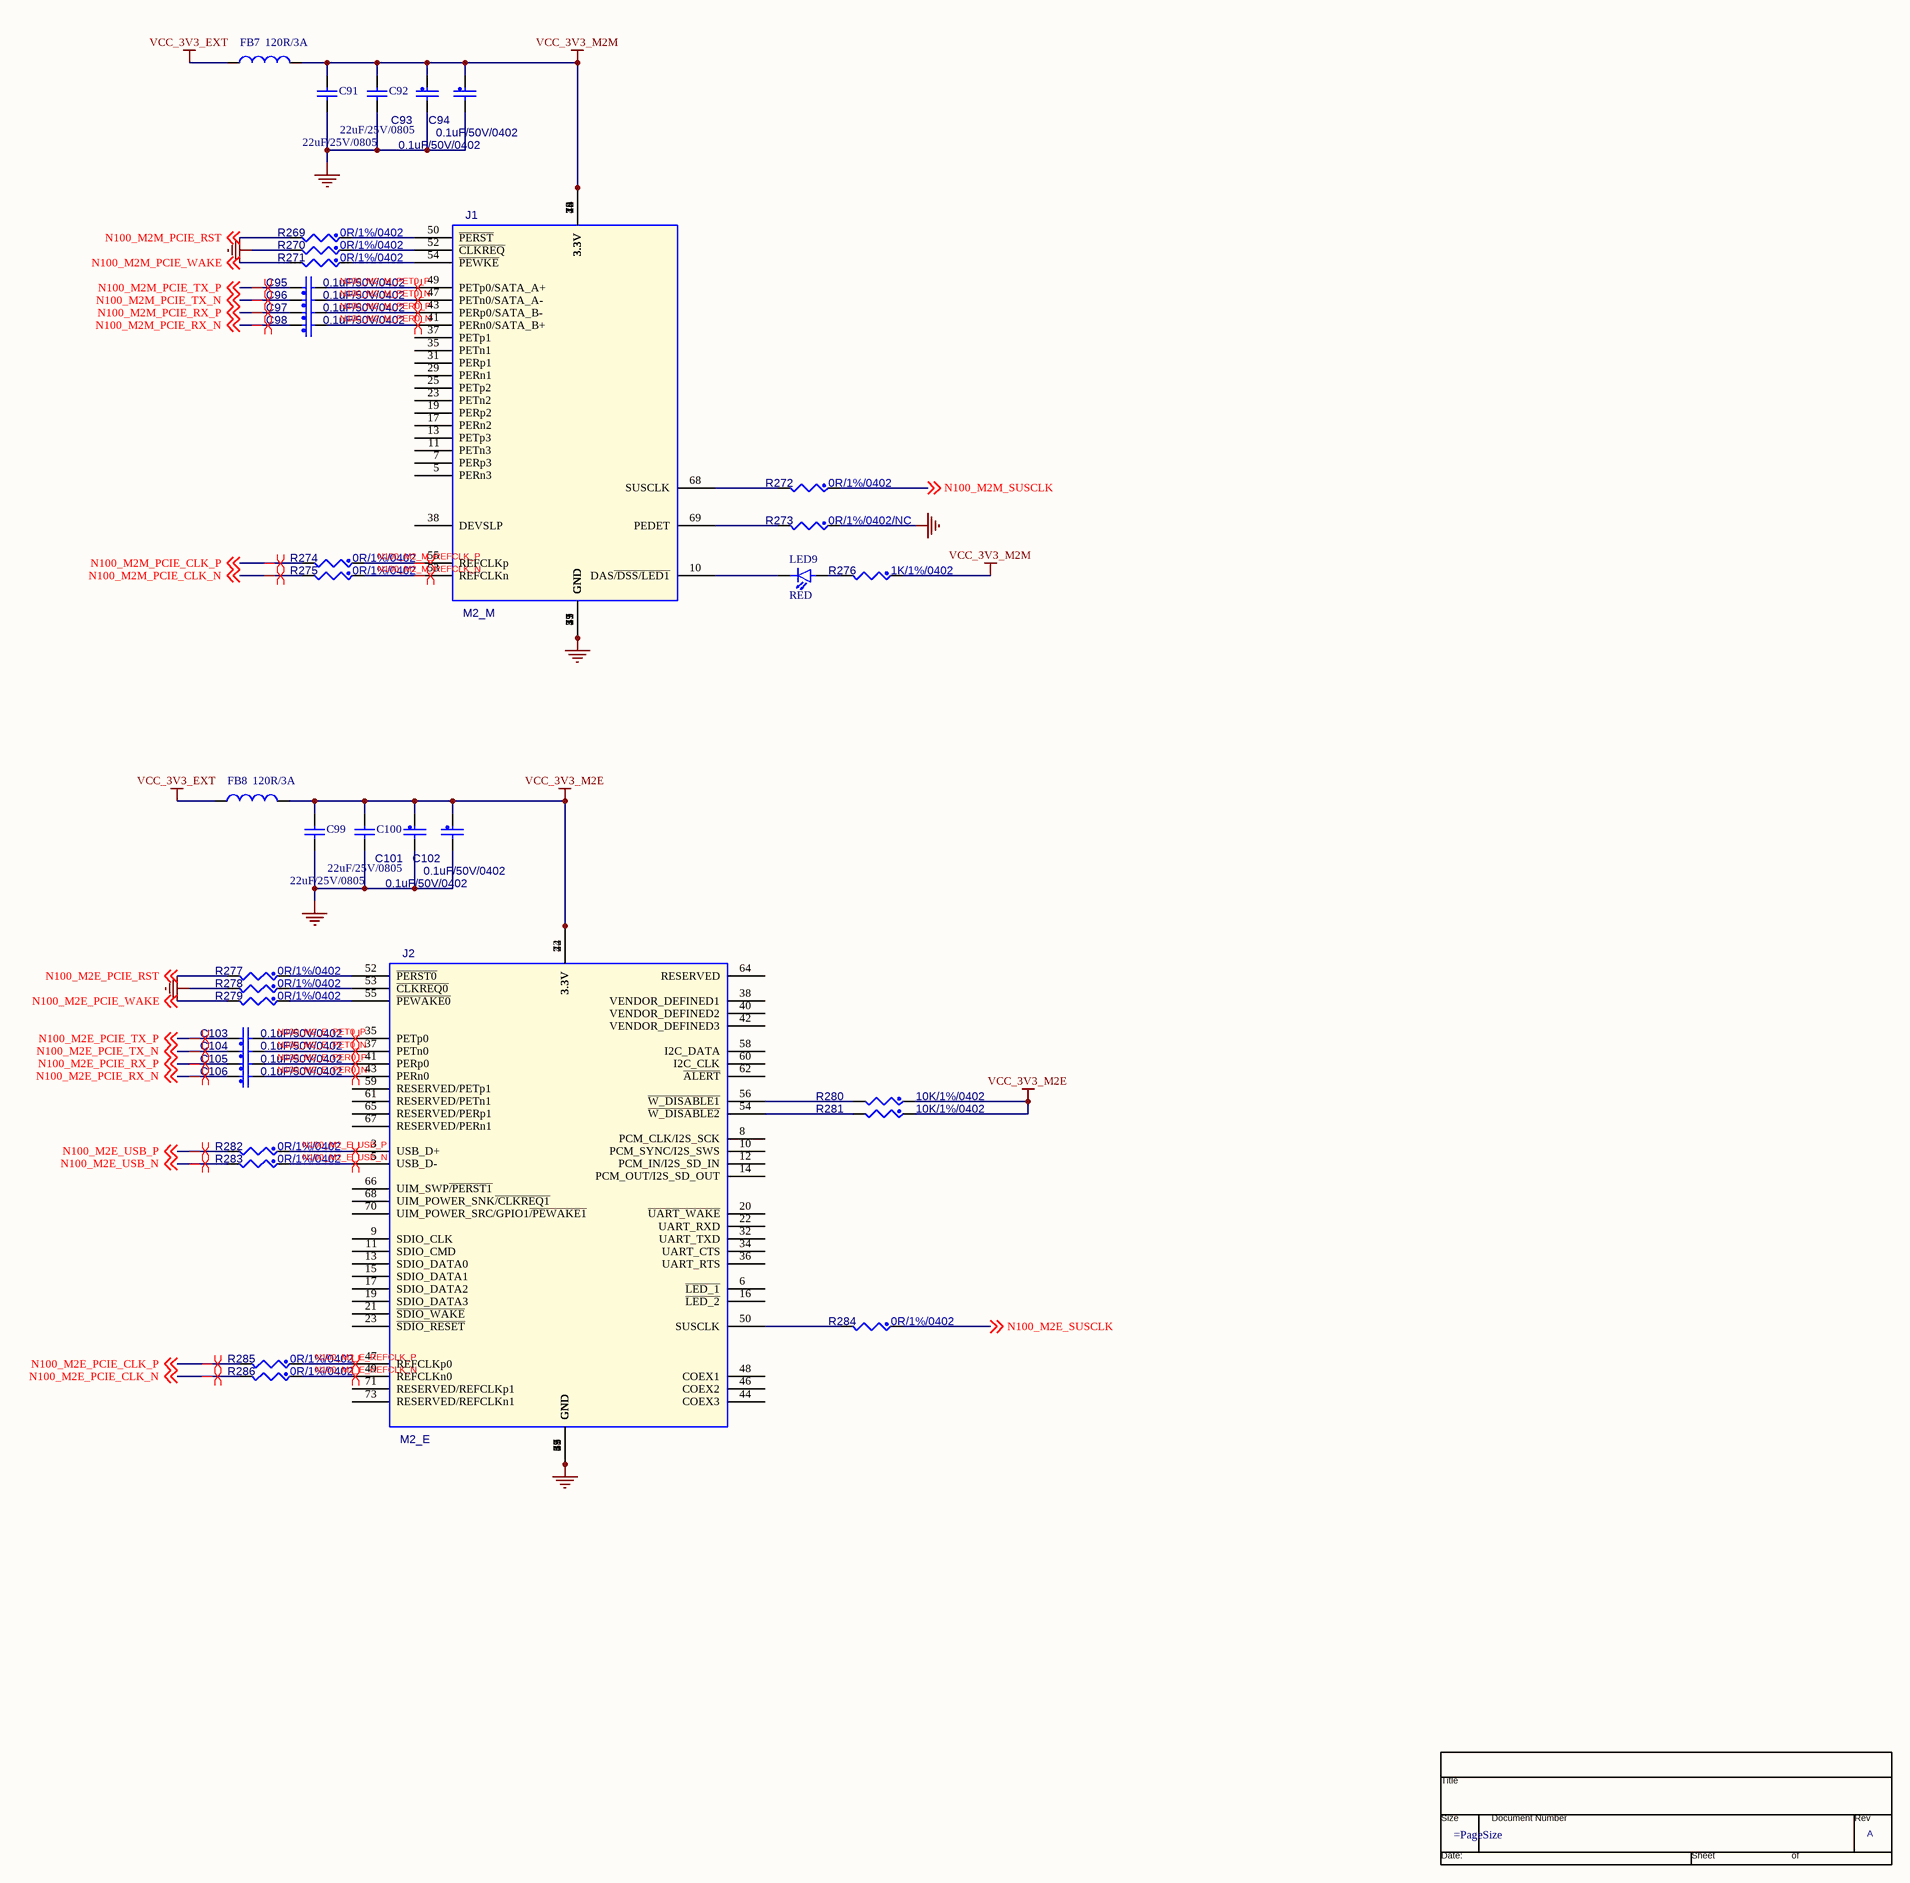
[diagram p11: 08-M2_E&M_KEY.SchDoc]

### Parts
(Parts that share a designator on the sheet are numbered #1, #2 ... from top to bottom, then left to right.)
*#7  RevCode: A  (graphical)
C91  22uF/25V/0805  [C0805]
C92  22uF/25V/0805  [C0805]
C93  value 0.1uF/50V/0402  [C0402]  (hidden comment: CAP_NP)
C94  value 0.1uF/50V/0402  [C0402]  (hidden comment: CAP_NP)
C95  value 0.1uF/50V/0402  [C0402]  (hidden comment: CAP_NP)
C96  value 0.1uF/50V/0402  [C0402]  (hidden comment: CAP_NP)
C97  value 0.1uF/50V/0402  [C0402]  (hidden comment: CAP_NP)
C98  value 0.1uF/50V/0402  [C0402]  (hidden comment: CAP_NP)
C99  22uF/25V/0805  [C0805]
C100  22uF/25V/0805  [C0805]
C101  value 0.1uF/50V/0402  [C0402]  (hidden comment: CAP_NP)
C102  value 0.1uF/50V/0402  [C0402]  (hidden comment: CAP_NP)
C103  value 0.1uF/50V/0402  [C0402]  (hidden comment: CAP_NP)
C104  value 0.1uF/50V/0402  [C0402]  (hidden comment: CAP_NP)
C105  value 0.1uF/50V/0402  [C0402]  (hidden comment: CAP_NP)
C106  value 0.1uF/50V/0402  [C0402]  (hidden comment: CAP_NP)
FB7  120R/3A  [L0603]
FB8  120R/3A  [L0603]
J1  M2_M  [PCIe_M.2_Connectors_P=0.5mm_H=4.2mm_KeyM]
J2  M2_E  [PCIe_M.2_Connectors_P=0.5mm_H=4.2mm_KeyE]
LED9  RED  [LED0603]
R269  value 0R/1%/0402  [R0402]  (hidden comment: RES_Dup2)
R270  value 0R/1%/0402  [R0402]  (hidden comment: RES_Dup2)
R271  value 0R/1%/0402  [R0402]  (hidden comment: RES_Dup2)
R272  value 0R/1%/0402  [R0402]  (hidden comment: RES_Dup2)
R273  value 0R/1%/0402/NC  [R0402]  (hidden comment: RES_Dup2)
R274  value 0R/1%/0402  [R0402]  (hidden comment: RES_Dup2)
R275  value 0R/1%/0402  [R0402]  (hidden comment: RES_Dup2)
R276  value 1K/1%/0402  [R0402]  (hidden comment: RES_Dup2)
R277  value 0R/1%/0402  [R0402]  (hidden comment: RES_Dup2)
R278  value 0R/1%/0402  [R0402]  (hidden comment: RES_Dup2)
R279  value 0R/1%/0402  [R0402]  (hidden comment: RES_Dup2)
R280  value 10K/1%/0402  [R0402]  (hidden comment: RES_Dup2)
R281  value 10K/1%/0402  [R0402]  (hidden comment: RES_Dup2)
R282  value 0R/1%/0402  [R0402]  (hidden comment: RES_Dup2)
R283  value 0R/1%/0402  [R0402]  (hidden comment: RES_Dup2)
R284  value 0R/1%/0402  [R0402]  (hidden comment: RES_Dup2)
R285  value 0R/1%/0402  [R0402]  (hidden comment: RES_Dup2)
R286  value 0R/1%/0402  [R0402]  (hidden comment: RES_Dup2)

### Nets
GND: C91.1 C92.1 C93.2 C94.2 C99.1 C100.1 C101.2 C102.2 J1.1(GND) J1.3(GND) J1.9(GND) J1.15(GND) J1.21(GND) J1.27(GND) J1.33(GND) J1.39(GND) J1.45(GND) J1.51(GND) J1.57(GND) J1.71(GND) J1.73(GND) J1.75(GND) J2.1(GND) J2.7(GND) J2.18(GND) J2.33(GND) J2.39(GND) J2.45(GND) J2.51(GND) J2.57(GND) J2.63(GND) J2.69(GND) J2.75(GND) R270.2 R273.1 R278.2
VCC_3V3_EXT: FB7.1 FB8.1
VCC_3V3_M2E: C99.2 C100.2 C101.1 C102.1 FB8.2 J2.2(3.3V) J2.4(3.3V) J2.72(3.3V) J2.74(3.3V) R280.1 R281.1
VCC_3V3_M2M: C91.2 C92.2 C93.1 C94.1 FB7.2 J1.2(3.3V) J1.4(3.3V) J1.12(3.3V) J1.14(3.3V) J1.16(3.3V) J1.18(3.3V) J1.70(3.3V) J1.72(3.3V) J1.74(3.3V) R276.1
N100_M2_E_PER0_N: C106.2 J2.43(PERn0)
N100_M2_E_PER0_P: C105.2 J2.41(PERp0)
N100_M2_E_PET0_N: C104.2 J2.37(PETn0)
N100_M2_E_PET0_P: C103.2 J2.35(PETp0)
N100_M2_E_REFCLK_N: J2.49(REFCLKn0) R286.1
N100_M2_E_REFCLK_P: J2.47(REFCLKp0) R285.1
N100_M2_E_USB_N: J2.5(USB_D-) R283.1
N100_M2_E_USB_P: J2.3(USB_D+) R282.1
N100_M2_M_PER0_N: C98.2 J1.41(PERn0/SATA_B+)
N100_M2_M_PER0_P: C97.2 J1.43(PERp0/SATA_B-)
N100_M2_M_PET0_N: C96.2 J1.47(PETn0/SATA_A-)
N100_M2_M_PET0_P: C95.2 J1.49(PETp0/SATA_A+)
N100_M2_M_REFCLK_N: J1.53(REFCLKn) R275.1
N100_M2_M_REFCLK_P: J1.55(REFCLKp) R274.1
N100_M2E_PCIE_CLK_N: R286.2 ; off-sheet N100_M2E_PCIE_CLK_N
N100_M2E_PCIE_CLK_P: R285.2 ; off-sheet N100_M2E_PCIE_CLK_P
N100_M2E_PCIE_RST: R269.2 R277.2 ; off-sheet N100_M2M_PCIE_RST, off-sheet N100_M2E_PCIE_RST  [also labelled N100_M2M_PCIE_RST]
N100_M2E_PCIE_RX_N: C106.1 ; off-sheet N100_M2E_PCIE_RX_N
N100_M2E_PCIE_RX_P: C105.1 ; off-sheet N100_M2E_PCIE_RX_P
N100_M2E_PCIE_TX_N: C104.1 ; off-sheet N100_M2E_PCIE_TX_N
N100_M2E_PCIE_TX_P: C103.1 ; off-sheet N100_M2E_PCIE_TX_P
N100_M2E_PCIE_WAKE: R271.2 R279.2 ; off-sheet N100_M2M_PCIE_WAKE, off-sheet N100_M2E_PCIE_WAKE  [also labelled N100_M2M_PCIE_WAKE]
N100_M2E_SUSCLK: R272.1 R284.1 ; off-sheet N100_M2M_SUSCLK, off-sheet N100_M2E_SUSCLK  [also labelled N100_M2M_SUSCLK]
N100_M2E_USB_N: R283.2 ; off-sheet N100_M2E_USB_N
N100_M2E_USB_P: R282.2 ; off-sheet N100_M2E_USB_P
N100_M2M_PCIE_CLK_N: R275.2 ; off-sheet N100_M2M_PCIE_CLK_N
N100_M2M_PCIE_CLK_P: R274.2 ; off-sheet N100_M2M_PCIE_CLK_P
N100_M2M_PCIE_RX_N: C98.1 ; off-sheet N100_M2M_PCIE_RX_N
N100_M2M_PCIE_RX_P: C97.1 ; off-sheet N100_M2M_PCIE_RX_P
N100_M2M_PCIE_TX_N: C96.1 ; off-sheet N100_M2M_PCIE_TX_N
N100_M2M_PCIE_TX_P: C95.1 ; off-sheet N100_M2M_PCIE_TX_P
NetJ1_10: J1.10(DAS~{/DSS/LED1}) LED9.2
NetJ1_50: J1.50(~{PERST}) R269.1
NetJ1_52: J1.52(~{CLKREQ}) R270.1
NetJ1_54: J1.54(~{PEWKE}) R271.1
NetJ1_68: J1.68(SUSCLK) R272.2
NetJ1_69: J1.69(PEDET) R273.2
NetJ2_50: J2.50(SUSCLK) R284.2
NetJ2_52: J2.52(~{PERST0}) R277.1
NetJ2_53: J2.53(~{CLKREQ0}) R278.1
NetJ2_54: J2.54(~{W_DISABLE2}) R281.2
NetJ2_55: J2.55(~{PEWAKE0}) R279.1
NetJ2_56: J2.56(~{W_DISABLE1}) R280.2
NetLED9_1: LED9.1 R276.2

Not connected (* = marked no-connect by the designer): J1 5(PERn3) 7(PERp3) 11(PETn3) 13(PETp3) 17(PERn2) 19(PERp2) 23(PETn2) 25(PETp2) 29(PERn1) 31(PERp1) 35(PETn1) 37(PETp1) 38(DEVSLP); J2 6(~{LED_1}) 8(PCM_CLK/I2S_SCK) 9(SDIO_CLK) 10(PCM_SYNC/I2S_SWS) 11(SDIO_CMD) 12(PCM_IN/I2S_SD_IN) 13(SDIO_DATA0) 14(PCM_OUT/I2S_SD_OUT) 15(SDIO_DATA1) 16(~{LED_2}) 17(SDIO_DATA2) 19(SDIO_DATA3) 20(~{UART_WAKE}) 21(~{SDIO_WAKE}) 22(UART_RXD) 23(~{SDIO_RESET}) 32(UART_TXD) 34(UART_CTS) 36(UART_RTS) 38(VENDOR_DEFINED1) 40(VENDOR_DEFINED2) 42(VENDOR_DEFINED3) 44(COEX3) 46(COEX2) 48(COEX1) 58(I2C_DATA) 59(RESERVED/PETp1) 60(I2C_CLK) 61(RESERVED/PETn1) 62(~{ALERT}) 64(RESERVED) 65(RESERVED/PERp1) 66(UIM_SWP~{/PERST1}) 67(RESERVED/PERn1) 68(UIM_POWER_SNK~{/CLKREQ1}) 70(UIM_POWER_SRC/GPIO1~{/PEWAKE1}) 71(RESERVED/REFCLKp1) 73(RESERVED/REFCLKn1)

### Layout directives
differential pair: N100_M2_E_PER0_N, N100_M2_E_PER0_P, N100_M2_E_PET0_N, N100_M2_E_PET0_P, N100_M2_E_REFCLK_N, N100_M2_E_REFCLK_P, N100_M2_E_USB_N, N100_M2_E_USB_P, N100_M2_M_PER0_N, N100_M2_M_PER0_P, N100_M2_M_PET0_N, N100_M2_M_PET0_P, N100_M2_M_REFCLK_N, N100_M2_M_REFCLK_P, N100_M2E_PCIE_CLK_N, N100_M2E_PCIE_CLK_P, N100_M2E_PCIE_RX_N, N100_M2E_PCIE_RX_P, N100_M2E_PCIE_TX_N, N100_M2E_PCIE_TX_P, N100_M2E_USB_N, N100_M2E_USB_P, N100_M2M_PCIE_CLK_N, N100_M2M_PCIE_CLK_P, N100_M2M_PCIE_RX_N, N100_M2M_PCIE_RX_P, N100_M2M_PCIE_TX_N, N100_M2M_PCIE_TX_P

### Notes on the sheet
- (in symbol TitleBlock0) Title; Size; Document Number; Rev; Date:; Sheet; of

### Library data of the parts
*#7 = TitleBlock0: as *#6 on sheet 07-N100; Page Size: =PageSize; Page Create Date: March  8, 1995; Page Modify Date: =ModifiedDate
C91 C92 C99 C100 = CAP: Capacitor; Value: 100pF; Published: 8-Jun-2000; Revision: July-2002: Re-released for DXP Platform.; Publisher: Altium Limited
C93-C98 C101-C106 = CAP_NP: as C71-C73 on sheet 06-RTL8111H-1; HEIGHT: 0.635MM; ROHS: Yes; TOL: 10%; PCB Footprint: C0402
FB7 FB8 = Inductor: as FB4 on sheet 06-RTL8111H-1; Published: 8-Jun-2000; LatestRevisionDate: 29-May-2009; LatestRevisionNote: IPC-7351 Footprint Added.; PackageReference: 0402-A; Publisher: Altium Limited; PackageDescription: Chip Inductor; Code_JEITA: 0402
J1 = M2_M: Part Reference: J2; PCB Footprint: M2_M; Value: M2_M
J2 = M2_E: Part Reference: J3; PCB Footprint: M2_E; Value: M2_E
LED9 = LED
R269-R279 R282-R286 = RES_Dup2: as R207 on sheet 05_RTL8211F; ROHS: Yes; HEIGHT: 0.4MM; PCB Footprint: R0402
R280 R281 = RES_Dup2: AC0402FR-0710KL/YAGEO; Part Reference: R94; CLASS: DISCRETE; PCB Footprint: R0402

## Sheet 09-RTL8111H-2.schdoc
size A2
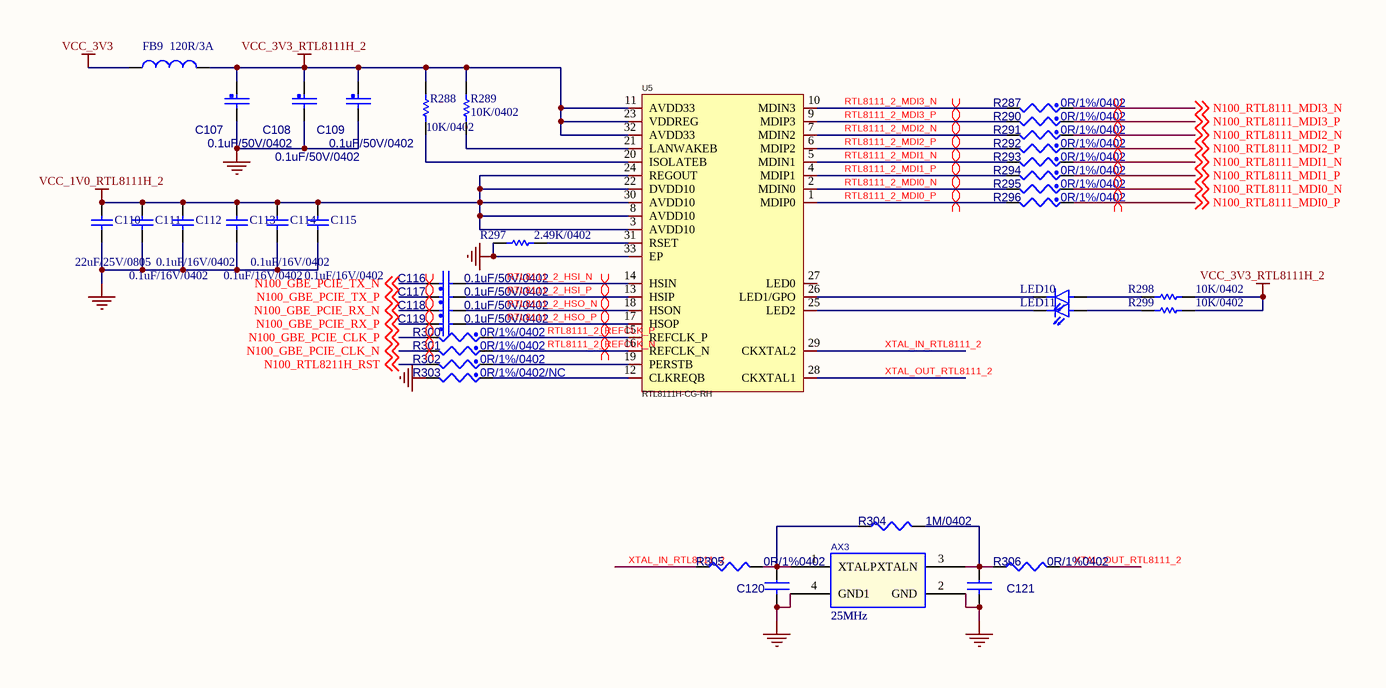
[diagram p12: 09-RTL8111H-2.schdoc]

### Parts
AX3  25MHz  [2016]
C107  value 0.1uF/50V/0402  [C0402]  (hidden comment: CAP_NP)
C108  value 0.1uF/50V/0402  [C0402]  (hidden comment: CAP_NP)
C109  value 0.1uF/50V/0402  [C0402]  (hidden comment: CAP_NP)
C110  22uF/25V/0805  [C0805]
C111  0.1uF/16V/0402  [C0402]
C112  0.1uF/16V/0402  [C0402]
C113  0.1uF/16V/0402  [C0402]
C114  0.1uF/16V/0402  [C0402]
C115  0.1uF/16V/0402  [C0402]
C116  value 0.1uF/50V/0402  [C0402]  (hidden comment: CAP_NP)
C117  value 0.1uF/50V/0402  [C0402]  (hidden comment: CAP_NP)
C118  value 0.1uF/50V/0402  [C0402]  (hidden comment: CAP_NP)
C119  value 0.1uF/50V/0402  [C0402]  (hidden comment: CAP_NP)
C120  CAP NP_Dup3  [C0402]  (value not drawn)
C121  CAP NP_Dup3  [C0402]  (value not drawn)
FB9  120R/3A  [L0603]
LED10  LED_GREEN  [LED0603]  (value not drawn)
LED11  LED_GREEN  [LED0603]  (value not drawn)
R287  value 0R/1%/0402  [R0402]  (hidden comment: RES_Dup2)
R288  10K/0402  [R0402]
R289  10K/0402  [R0402]
R290  value 0R/1%/0402  [R0402]  (hidden comment: RES_Dup2)
R291  value 0R/1%/0402  [R0402]  (hidden comment: RES_Dup2)
R292  value 0R/1%/0402  [R0402]  (hidden comment: RES_Dup2)
R293  value 0R/1%/0402  [R0402]  (hidden comment: RES_Dup2)
R294  value 0R/1%/0402  [R0402]  (hidden comment: RES_Dup2)
R295  value 0R/1%/0402  [R0402]  (hidden comment: RES_Dup2)
R296  value 0R/1%/0402  [R0402]  (hidden comment: RES_Dup2)
R297  2.49K/0402  [R0402]
R298  10K/0402  [R0402]
R299  10K/0402  [R0402]
R300  value 0R/1%/0402  [R0402]  (hidden comment: RES_Dup2)
R301  value 0R/1%/0402  [R0402]  (hidden comment: RES_Dup2)
R302  value 0R/1%/0402  [R0402]  (hidden comment: RES_Dup2)
R303  value 0R/1%/0402/NC  [R0402]  (hidden comment: RES_Dup2)
R304  value 1M/0402  [R0402]  (hidden comment: R_Dup3)
R305  value 0R/1%0402  [R0402]  (hidden comment: R_Dup3)
R306  value 0R/1%0402  [R0402]  (hidden comment: R_Dup3)
U5  RTL8111H-CG-RH  [RTL8111H-CG-RH]

### Nets
GND: AX3.2(GND) AX3.4(GND1) C107.2 C108.2 C109.2 C110.1 C111.1 C112.1 C113.1 C114.1 C115.1 C120.2 C121.2 R297.1 R303.2 U5.33(EP)
VCC_1V0_RTL8111H_2: C110.2 C111.2 C112.2 C113.2 C114.2 C115.2 U5.3(AVDD10) U5.8(AVDD10) U5.22(DVDD10) U5.24(REGOUT) U5.30(AVDD10)
VCC_3V3: FB9.1  [project net 3V3_ORIN_F1]
VCC_3V3_RTL8111H_2: C107.1 C108.1 C109.1 FB9.2 R288.1 R289.1 R298.1 R299.1 U5.11(AVDD33) U5.23(VDDREG) U5.32(AVDD33)
N100_GBE_PCIE_CLK_N: R301.2 ; off-sheet N100_GBE_PCIE_CLK_N
N100_GBE_PCIE_CLK_P: R300.2 ; off-sheet N100_GBE_PCIE_CLK_P
N100_GBE_PCIE_RX_N: C118.1 ; off-sheet N100_GBE_PCIE_RX_N
N100_GBE_PCIE_RX_P: C119.1 ; off-sheet N100_GBE_PCIE_RX_P
N100_GBE_PCIE_TX_N: C116.1 ; off-sheet N100_GBE_PCIE_TX_N
N100_GBE_PCIE_TX_P: C117.1 ; off-sheet N100_GBE_PCIE_TX_P
N100_RTL8111_MDI0_N: R295.1 ; off-sheet N100_RTL8111_MDI0_N
N100_RTL8111_MDI0_P: R296.1 ; off-sheet N100_RTL8111_MDI0_P
N100_RTL8111_MDI1_N: R293.1 ; off-sheet N100_RTL8111_MDI1_N
N100_RTL8111_MDI1_P: R294.1 ; off-sheet N100_RTL8111_MDI1_P
N100_RTL8111_MDI2_N: R291.1 ; off-sheet N100_RTL8111_MDI2_N
N100_RTL8111_MDI2_P: R292.1 ; off-sheet N100_RTL8111_MDI2_P
N100_RTL8111_MDI3_N: R287.1 ; off-sheet N100_RTL8111_MDI3_N
N100_RTL8111_MDI3_P: R290.1 ; off-sheet N100_RTL8111_MDI3_P
N100_RTL8211H_RST: R302.2 ; off-sheet N100_RTL8211H_RST  [project net N100_M2E_PCIE_RST]
RTL8111_2_HSI_N: C116.2 U5.14(HSIN)
RTL8111_2_HSI_P: C117.2 U5.13(HSIP)
RTL8111_2_HSO_N: C118.2 U5.18(HSON)
RTL8111_2_HSO_P: C119.2 U5.17(HSOP)
RTL8111_2_MDI0_N: R295.2 U5.2(MDIN0)
RTL8111_2_MDI0_P: R296.2 U5.1(MDIP0)
RTL8111_2_MDI1_N: R293.2 U5.5(MDIN1)
RTL8111_2_MDI1_P: R294.2 U5.4(MDIP1)
RTL8111_2_MDI2_N: R291.2 U5.7(MDIN2)
RTL8111_2_MDI2_P: R292.2 U5.6(MDIP2)
RTL8111_2_MDI3_N: R287.2 U5.10(MDIN3)
RTL8111_2_MDI3_P: R290.2 U5.9(MDIP3)
RTL8111_2_REFCLK_N: R301.1 U5.16(REFCLK_N)
RTL8111_2_REFCLK_P: R300.1 U5.15(REFCLK_P)
XTAL_IN_RTL8111_2: R305.1 U5.29(CKXTAL2)
XTAL_OUT_RTL8111_2: R306.2 U5.28(CKXTAL1)
NetAX3_1: AX3.1(XTALP) C120.1 R304.1 R305.2
NetAX3_3: AX3.3(XTALN) C121.1 R304.2 R306.1
NetLED10_1: LED10.1 R298.2
NetLED10_2: LED10.2 U5.26(LED1/GPO)
NetLED11_1: LED11.1 R299.2
NetLED11_2: LED11.2 U5.25(LED2)
NetR288_2: R288.2 U5.20(ISOLATEB)
NetR289_2: R289.2 U5.21(LANWAKEB)
NetR297_2: R297.2 U5.31(RSET)
NetR302_1: R302.1 U5.19(PERSTB)
NetR303_1: R303.1 U5.12(CLKREQB)

Not connected (* = marked no-connect by the designer): U5 27(LED0)

### Layout directives
differential pair: N100_GBE_PCIE_CLK_N, N100_GBE_PCIE_CLK_P, N100_GBE_PCIE_RX_N, N100_GBE_PCIE_RX_P, N100_GBE_PCIE_TX_N, N100_GBE_PCIE_TX_P, N100_RTL8111_MDI0_N, N100_RTL8111_MDI0_P, N100_RTL8111_MDI1_N, N100_RTL8111_MDI1_P, N100_RTL8111_MDI2_N, N100_RTL8111_MDI2_P, N100_RTL8111_MDI3_N, N100_RTL8111_MDI3_P, RTL8111_2_HSI_N, RTL8111_2_HSI_P, RTL8111_2_HSO_N, RTL8111_2_HSO_P, RTL8111_2_MDI0_N, RTL8111_2_MDI0_P, RTL8111_2_MDI1_N, RTL8111_2_MDI1_P, RTL8111_2_MDI2_N, RTL8111_2_MDI2_P, RTL8111_2_MDI3_N, RTL8111_2_MDI3_P, RTL8111_2_REFCLK_N, RTL8111_2_REFCLK_P

### Library data of the parts
AX3 = XTAL_0: as AX1 on sheet 05_RTL8211F; Value: 25MHz
C107-C109 C116-C119 = CAP_NP: as C71-C73 on sheet 06-RTL8111H-1; HEIGHT: 0.635MM; ROHS: Yes; TOL: 10%; PCB Footprint: C0402
C110-C115 = CAP: Capacitor; Value: 100pF; Published: 8-Jun-2000; Revision: July-2002: Re-released for DXP Platform.; Publisher: Altium Limited
C120 = CAP NP_Dup3: Part Reference: C71; Value: 20pF/50V X7R; PCB Footprint: C0402
C121 = CAP NP_Dup3: Part Reference: C72; Value: 20pF/50V X7R; PCB Footprint: C0402
FB9 = Inductor: as FB4 on sheet 06-RTL8111H-1; Published: 8-Jun-2000; LatestRevisionDate: 29-May-2009; LatestRevisionNote: IPC-7351 Footprint Added.; PackageReference: 0402-A; Publisher: Altium Limited; PackageDescription: Chip Inductor; Code_JEITA: 0402
LED10 LED11 = LED
R287 R300 = RES_Dup2: as R207 on sheet 05_RTL8211F; ROHS: Yes; HEIGHT: 0.4MM; PCB Footprint: R0402
R288 R289 R297 = Res Semi: Semiconductor Resistor; Value: 240R; Published: 8-Jun-2000; LatestRevisionDate: 17-Jul-2002; LatestRevisionNote: Re-released for DXP Platform.; PackageReference: AXIAL-0.5; Publisher: Altium Limited; PackageDescription: Axial Device, Thru-Hole; 2 Leads; 0.5 in Pin Spacing
R290 R301-R303 = RES_Dup2: as R208 on sheet 05_RTL8211F; HEIGHT: 0.4MM; ROHS: Yes; PCB Footprint: R0402
R291 = RES_Dup2: as R247 on sheet 06-RTL8111H-1; HEIGHT: 0.4MM; ROHS: Yes; PCB Footprint: R0402
R292 = RES_Dup2: as R248 on sheet 06-RTL8111H-1; HEIGHT: 0.4MM; ROHS: Yes; PCB Footprint: R0402
R293 = RES_Dup2: as R249 on sheet 06-RTL8111H-1; HEIGHT: 0.4MM; ROHS: Yes; PCB Footprint: R0402
R294 = RES_Dup2: as R250 on sheet 06-RTL8111H-1; HEIGHT: 0.4MM; ROHS: Yes; PCB Footprint: R0402
R295 = RES_Dup2: as R251 on sheet 06-RTL8111H-1; HEIGHT: 0.4MM; ROHS: Yes; PCB Footprint: R0402
R296 = RES_Dup2: as R252 on sheet 06-RTL8111H-1; HEIGHT: 0.4MM; ROHS: Yes; PCB Footprint: R0402
R298 R299 = Res Semi: Semiconductor Resistor; Value: 1K; Published: 8-Jun-2000; LatestRevisionDate: 17-Jul-2002; LatestRevisionNote: Re-released for DXP Platform.; PackageReference: AXIAL-0.5; Publisher: Altium Limited; PackageDescription: Axial Device, Thru-Hole; 2 Leads; 0.5 in Pin Spacing
R304 R305 = R_Dup3: Part Reference: R130; PCB Footprint: R0402
R306 = R_Dup3: Part Reference: R131; PCB Footprint: R0402
U5 = RTL8111H-CG: as U3 on sheet 06-RTL8111H-1; Symbol: RTL8111H-CG; Device: RTL8111H-CG; LCSC Part Name: RTL8111H-CG; Supplier Part: C2761340; Manufacturer Part: RTL8111H-CG; Supplier Footprint: QFN-32-EP(4x4); JLCPCB Part Class: Extended Part; Datasheet: https://atta.szlcsc.com/upload/public/pdf/source/20210810/FF05C5D46F518898BC2EC053E52D54B5.pdf; Supplier: LCSC; Convert to PCB: yes; Comment_1: RTL8111H-CG

## Sheet 10-ESP32.SchDoc: KARGOBOT-TBOX-V2.0
size 513 x 386 mm; Page Create Date: March  8, 1995; Page Number: 4; Page Size: C; Page Count: 81; RevCode: A; DsnPath: C:\Users\Administrator\Desktop\123\KARGOBOT-TCU-ORIN-V1.1.DSN; SchematicName: KARGOBT-TCU-ORIN-V1.1; PageName: N100; PageSize: C; TopSchematic: True
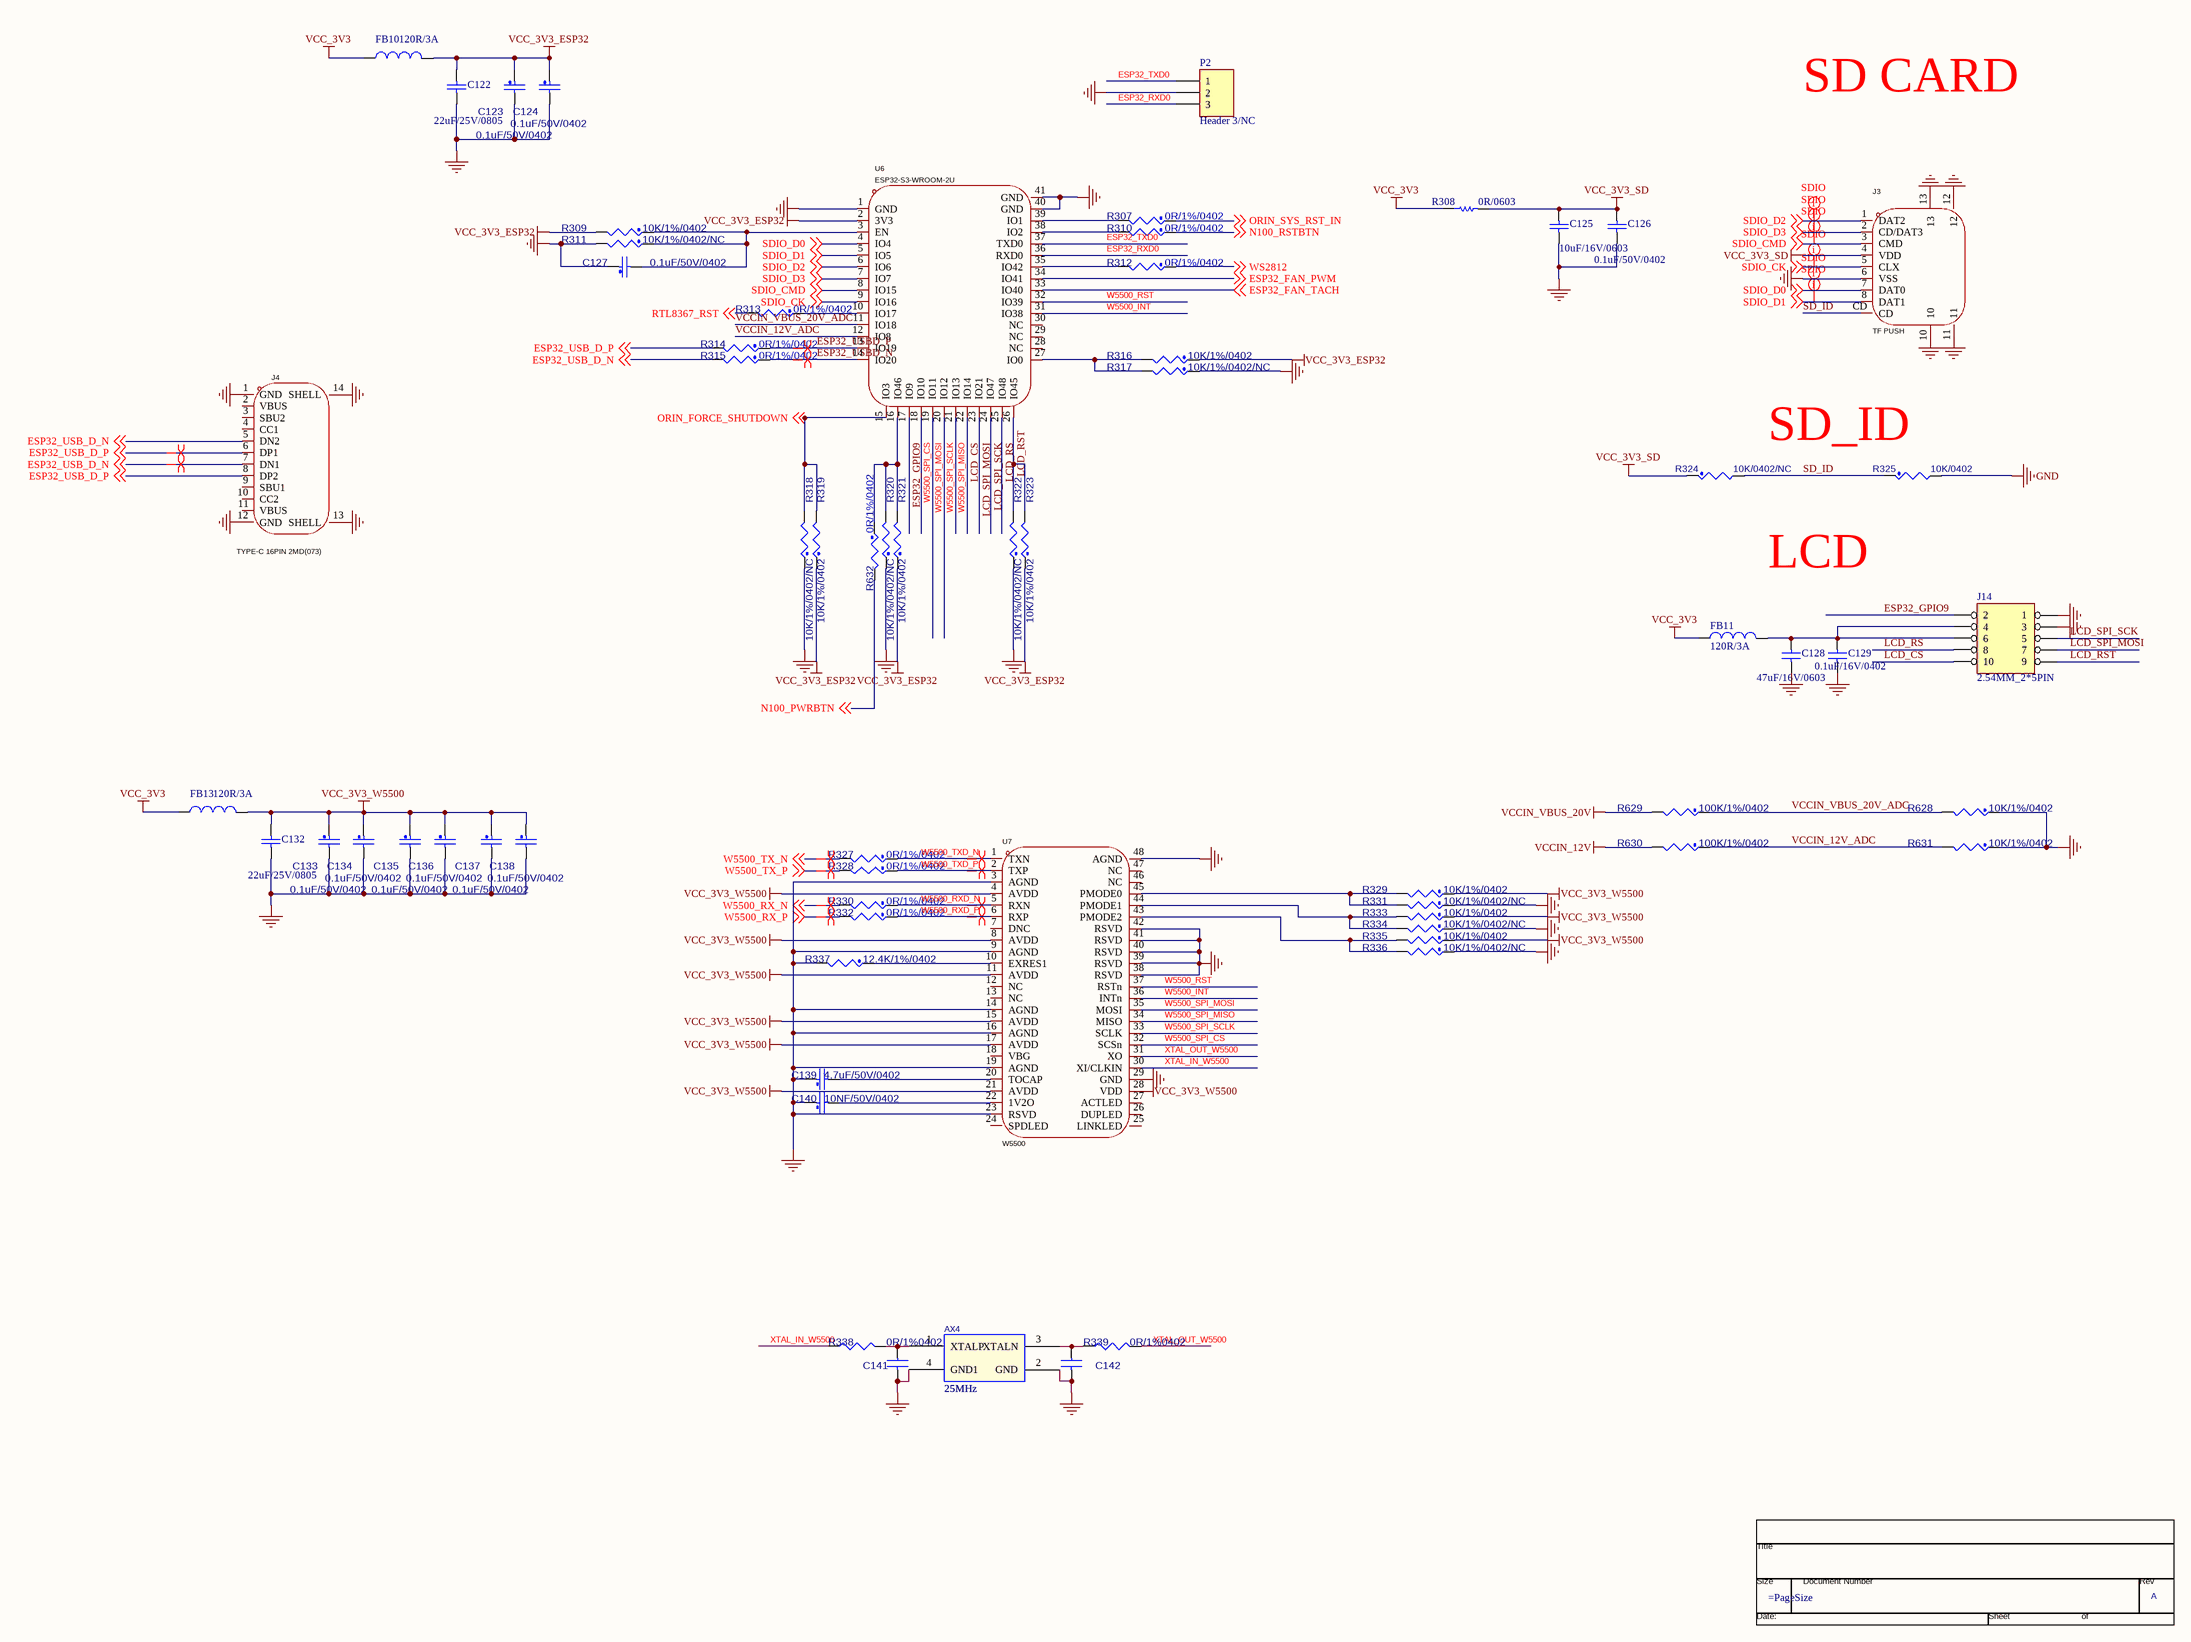
[diagram p13: 10-ESP32.SchDoc]

### Parts
(Parts that share a designator on the sheet are numbered #1, #2 ... from top to bottom, then left to right.)
*#8  RevCode: A  (graphical)
AX4  25MHz  [2016]
C122  22uF/25V/0805  [C0805]
C123  value 0.1uF/50V/0402  [C0402]  (hidden comment: CAP_NP)
C124  value 0.1uF/50V/0402  [C0402]  (hidden comment: CAP_NP)
C125  value 10uF/16V/0603  [C0603]  (hidden comment: HGC0603R5106M160NTHJ)
C126  0.1uF/50V/0402  [C0402]
C127  value 0.1uF/50V/0402  [C0402]  (hidden comment: CAP_NP)
C128  47uF/16V/0603  [C0603]
C129  0.1uF/16V/0402  [C0402]
C132  22uF/25V/0805  [C0805]
C133  value 0.1uF/50V/0402  [C0402]  (hidden comment: CAP_NP)
C134  value 0.1uF/50V/0402  [C0402]  (hidden comment: CAP_NP)
C135  value 0.1uF/50V/0402  [C0402]  (hidden comment: CAP_NP)
C136  value 0.1uF/50V/0402  [C0402]  (hidden comment: CAP_NP)
C137  value 0.1uF/50V/0402  [C0402]  (hidden comment: CAP_NP)
C138  value 0.1uF/50V/0402  [C0402]  (hidden comment: CAP_NP)
C139  value 4.7uF/50V/0402  [C0402]  (hidden comment: CAP_NP)
C140  value 10NF/50V/0402  [C0402]  (hidden comment: CAP_NP)
C141  CAP NP_Dup3  [C0402]  (value not drawn)
C142  CAP NP_Dup3  [C0402]  (value not drawn)
FB10  120R/3A  [L0603]
FB11  120R/3A  [L0603]
FB13  120R/3A  [L0603]
J3  TF PUSH  [TF-SMD_TF-PUSH]
J4  TYPE-C 16PIN 2MD(073)  [USB-C-SMD_TYPE-C-6PIN-2MD-073]
J14  2.54MM_2*5PIN  [IDC10]
P2  Header 3/NC  [HEADER3]
R307  value 0R/1%/0402  [R0402]  (hidden comment: RES_Dup2)
R308  0R/0603  [R0603]
R309  value 10K/1%/0402  [R0402]  (hidden comment: RES_Dup2)
R310  value 0R/1%/0402  [R0402]  (hidden comment: RES_Dup2)
R311  value 10K/1%/0402/NC  [R0402]  (hidden comment: RES_Dup2)
R312  value 0R/1%/0402  [R0402]  (hidden comment: RES_Dup2)
R313  value 0R/1%/0402  [R0402]  (hidden comment: RES_Dup2)
R314  value 0R/1%/0402  [R0402]  (hidden comment: RES_Dup2)
R315  value 0R/1%/0402  [R0402]  (hidden comment: RES_Dup2)
R316  value 10K/1%/0402  [R0402]  (hidden comment: RES_Dup2)
R317  value 10K/1%/0402/NC  [R0402]  (hidden comment: RES_Dup2)
R318  value 10K/1%/0402/NC  [R0402]  (hidden comment: RES_Dup2)
R319  value 10K/1%/0402  [R0402]  (hidden comment: RES_Dup2)
R320  value 10K/1%/0402/NC  [R0402]  (hidden comment: RES_Dup2)
R321  value 10K/1%/0402  [R0402]  (hidden comment: RES_Dup2)
R322  value 10K/1%/0402/NC  [R0402]  (hidden comment: RES_Dup2)
R323  value 10K/1%/0402  [R0402]  (hidden comment: RES_Dup2)
R324  10K/0402/NC  [R0402]
R325  10K/0402  [R0402]
R327  value 0R/1%/0402  [R0402]  (hidden comment: RES_Dup2)
R328  value 0R/1%/0402  [R0402]  (hidden comment: RES_Dup2)
R329  value 10K/1%/0402  [R0402]  (hidden comment: RES_Dup2)
R330  value 0R/1%/0402  [R0402]  (hidden comment: RES_Dup2)
R331  value 10K/1%/0402/NC  [R0402]  (hidden comment: RES_Dup2)
R332  value 0R/1%/0402  [R0402]  (hidden comment: RES_Dup2)
R333  value 10K/1%/0402  [R0402]  (hidden comment: RES_Dup2)
R334  value 10K/1%/0402/NC  [R0402]  (hidden comment: RES_Dup2)
R335  value 10K/1%/0402  [R0402]  (hidden comment: RES_Dup2)
R336  value 10K/1%/0402/NC  [R0402]  (hidden comment: RES_Dup2)
R337  value 12.4K/1%/0402  [R0402]  (hidden comment: RES_Dup2)
R338  value 0R/1%0402  [R0402]  (hidden comment: R_Dup3)
R339  value 0R/1%0402  [R0402]  (hidden comment: R_Dup3)
R628  value 10K/1%/0402  [R0402]  (hidden comment: RES_Dup2)
R629  value 100K/1%/0402  [R0402]  (hidden comment: RES_Dup2)
R630  value 100K/1%/0402  [R0402]  (hidden comment: RES_Dup2)
R631  value 10K/1%/0402  [R0402]  (hidden comment: RES_Dup2)
R632  value 0R/1%/0402  [R0402]  (hidden comment: RES_Dup2)
U6  ESP32-S3-WROOM-2U  [ESP32-S3-WROOM-2]
U7  W5500  [LQFP-48_L7.0-W7.0-P0.50-LS9.0-BL]

### Nets
GND: AX4.2(GND) AX4.4(GND1) C122.1 C123.2 C124.2 C125.1 C126.1 C127.1 C128.1 C129.1 C132.1 C133.2 C134.2 C135.2 C136.2 C137.2 C138.2 C139.1 C140.1 C141.2 C142.2 J3.6(VSS) J3.10 J3.11 J3.12 J3.13 J4.1(GND) J4.12(GND) J4.13(SHELL) J4.14(SHELL) J14.1 J14.3 P2.2 R311.2 R317.1 R318.1 R320.1 R322.1 R325.2 R331.1 R334.1 R336.1 R337.2 R628.1 R631.1 U6.1(GND) U6.40(GND) U6.41(GND) U7.3(AGND) U7.9(AGND) U7.14(AGND) U7.16(AGND) U7.19(AGND) U7.23(RSVD) U7.29(GND) U7.38(RSVD) U7.39(RSVD) U7.40(RSVD) U7.41(RSVD) U7.42(RSVD) U7.48(AGND)
VCC_3V3: FB10.1 FB11.2 FB13.1 R308.1  [project net 3V3_ORIN_F1]
VCC_3V3_ESP32: C122.2 C123.1 C124.1 FB10.2 R309.2 R316.1 R319.1 R321.1 R323.1 U6.2(3V3)
VCC_3V3_SD: C125.2 C126.2 J3.4(VDD) R308.2 R324.1
VCC_3V3_W5500: C132.2 C133.1 C134.1 C135.1 C136.1 C137.1 C138.1 FB13.2 R329.1 R333.1 R335.1 U7.4(AVDD) U7.8(AVDD) U7.11(AVDD) U7.15(AVDD) U7.17(AVDD) U7.21(AVDD) U7.28(VDD)
VCCIN_12V: R630.2
VCCIN_VBUS_20V: R629.2
ESP32_FAN_PWM: U6.34(IO41) ; off-sheet ESP32_FAN_PWM
ESP32_FAN_TACH: U6.33(IO40) ; off-sheet ESP32_FAN_TACH
ESP32_GPIO9: J14.2 U6.17(IO9)
ESP32_RXD0: P2.3 U6.36(RXD0)
ESP32_TXD0: P2.1 U6.37(TXD0)
ESP32_USB_D_N: J4.5(DN2) J4.7(DN1) R315.2 ; off-sheet ESP32_USB_D_N
ESP32_USB_D_P: J4.6(DP1) J4.8(DP2) R314.2 ; off-sheet ESP32_USB_D_P
ESP32_USBD_N: R315.1 U6.14(IO20)
ESP32_USBD_P: R314.1 U6.13(IO19)
LCD_CS: J14.10 U6.22(IO14)
LCD_RS: J14.8 U6.25(IO48)
LCD_RST: J14.9 R322.2 R323.2 U6.26(IO45)
LCD_SPI_MOSI: J14.7 U6.23(IO21)
LCD_SPI_SCK: J14.5 U6.24(IO47)
N100_PWRBTN: R632.2 ; off-sheet N100_PWRBTN
N100_RSTBTN: R310.1 ; off-sheet N100_RSTBTN
ORIN_FORCE_SHUTDOWN: R318.2 R319.2 U6.15(IO3) ; off-sheet ORIN_FORCE_SHUTDOWN
ORIN_SYS_RST_IN: R307.1 ; off-sheet ORIN_SYS_RST_IN  [project net SYS_RST_IN*]
RTL8367_RST: R313.2 ; off-sheet RTL8367_RST  [project net RST]
SD_ID: J3.CD R324.2 R325.1
SDIO_CK: J3.5(CLX) U6.9(IO16) ; off-sheet SDIO_CK
SDIO_CMD: J3.3(CMD) U6.8(IO15) ; off-sheet SDIO_CMD
SDIO_D0: J3.7(DAT0) U6.4(IO4) ; off-sheet SDIO_D0
SDIO_D1: J3.8(DAT1) U6.5(IO5) ; off-sheet SDIO_D1
SDIO_D2: J3.1(DAT2) U6.6(IO6) ; off-sheet SDIO_D2
SDIO_D3: J3.2(CD/DAT3) U6.7(IO7) ; off-sheet SDIO_D3
VCCIN_12V_ADC: R630.1 R631.2 U6.12(IO8)
VCCIN_VBUS_20V_ADC: R628.2 R629.1 U6.11(IO18)
W5500_INT: U6.31(IO38) U7.36(INTn)
W5500_RST: U6.32(IO39) U7.37(RSTn)
W5500_RX_N: R330.2 ; off-sheet W5500_RX_N
W5500_RX_P: R332.2 ; off-sheet W5500_RX_P
W5500_RXD_N: R330.1 U7.5(RXN)
W5500_RXD_P: R332.1 U7.6(RXP)
W5500_SPI_CS: U6.18(IO10) U7.32(SCSn)
W5500_SPI_MISO: U6.21(IO13) U7.34(MISO)
W5500_SPI_MOSI: U6.19(IO11) U7.35(MOSI)
W5500_SPI_SCLK: U6.20(IO12) U7.33(SCLK)
W5500_TX_N: R327.2 ; off-sheet W5500_TX_N
W5500_TX_P: R328.2 ; off-sheet W5500_TX_P
W5500_TXD_N: R327.1 U7.1(TXN)
W5500_TXD_P: R328.1 U7.2(TXP)
WS2812: R312.1 ; off-sheet WS2812
XTAL_IN_W5500: R338.1 U7.30(XI/CLKIN)
XTAL_OUT_W5500: R339.2 U7.31(XO)
NetAX4_1: AX4.1(XTALP) C141.1 R338.2
NetAX4_3: AX4.3(XTALN) C142.1 R339.1
NetC127_2: C127.2 R309.1 R311.1 U6.3(EN)
NetC128_2: C128.2 C129.2 FB11.1 J14.4 J14.6
NetC139_2: C139.2 U7.20(TOCAP)
NetC140_2: C140.2 U7.22(1V2O)
NetR307_2: R307.2 U6.39(IO1)
NetR310_2: R310.2 U6.38(IO2)
NetR312_2: R312.2 U6.35(IO42)
NetR313_1: R313.1 U6.10(IO17)
NetR316_2: R316.2 R317.2 U6.27(IO0)
NetR320_2: R320.2 R321.2 R632.1 U6.16(IO46)
NetR329_2: R329.2 R331.2 U7.45(PMODE0)
NetR333_2: R333.2 R334.2 U7.44(PMODE1)
NetR335_2: R335.2 R336.2 U7.43(PMODE2)
NetR337_1: R337.1 U7.10(EXRES1)

Not connected (* = marked no-connect by the designer): J4 2(VBUS) 3(SBU2) 4(CC1) 9(SBU1) 10(CC2) 11(VBUS); U6 28(NC) 29(NC) 30(NC); U7 7(DNC) 12(NC) 13(NC) 18(VBG) 24(SPDLED) 25(LINKLED) 26(DUPLED) 27(ACTLED) 46(NC) 47(NC)

### Layout directives
net class SDIO: SDIO_CK, SDIO_CMD, SDIO_D0, SDIO_D1, SDIO_D2, SDIO_D3
differential pair: ESP32_USB_D_N, ESP32_USB_D_P, ESP32_USBD_N, ESP32_USBD_P, W5500_RX_N, W5500_RX_P, W5500_RXD_N, W5500_RXD_P, W5500_TX_N, W5500_TX_P, W5500_TXD_N, W5500_TXD_P

### Notes on the sheet
- SD CARD
- (near R325) SD_ID
- LCD
- (in symbol TitleBlock0) Title; Size; Document Number; Rev; Date:; Sheet; of

### Library data of the parts
*#8 = TitleBlock0: Page Count: 81; Page Number: 4; Title: KARGOBOT-TBOX-V2.0; Page Size: =PageSize; Page Create Date: March  8, 1995; Page Modify Date: =ModifiedDate
AX4 = XTAL_0: Part Reference: AX3; PCB Footprint: CRY5032; Value: 25MHz
C122 C126 C128 C129 C132 = CAP: Capacitor; Value: 100pF; Published: 8-Jun-2000; Revision: July-2002: Re-released for DXP Platform.; Publisher: Altium Limited
C123 C124 C127 C133-C140 = CAP_NP: GCM155R71H104KE02/MURATA; Part Reference: C15; CLASS: DISCRETE; FPLIST: CC0402_25,CC0402_HD,CC0402_CC; CAD_APPROVED: Yes; MFG_PN01: 0402YC104KAT2A; MFG_NAME01: AVX; Tolerance: 10%; AGILE_PN: 150-75182; VOLTAGE: 16V; HEIGHT: 0.635MM; ROHS: Yes; TOL: 10%; PCB Footprint: C0402
C125 = CAP: Capacitor; Published: 8-Jun-2000; Revision: July-2002: Re-released for DXP Platform.; Publisher: Altium Limited
C141 = CAP NP_Dup3: Part Reference: C71; Value: 20pF/50V X7R; PCB Footprint: C0402
C142 = CAP NP_Dup3: Part Reference: C72; Value: 20pF/50V X7R; PCB Footprint: C0402
FB10 FB11 FB13 = Inductor: BLM18KG121TN1D; Code_IEC: 1005; Value: 10mH; Published: 8-Jun-2000; LatestRevisionDate: 29-May-2009; LatestRevisionNote: IPC-7351 Footprint Added.; PackageReference: 0402-A; Publisher: Altium Limited; PackageDescription: Chip Inductor; Code_JEITA: 0402
J3 = TF PUSH: Manufacturer: SHOU HAN(首韩); Add into BOM: yes; Card Connection Mode: 自弹式; Card Type: MicroSD卡(TF卡); Connector Type: 卡座; Maximum Body Height: 2mm; Additional Card Detection Pins: 无; Symbol: TF PUSH; Device: TF PUSH; LCSC Part Name: 自弹式 MicroSD卡(TF卡) 卡座; Supplier Part: C393941; Manufacturer Part: TF PUSH; Supplier Footprint: SMD; JLCPCB Part Class: Extended Part; Datasheet: https://atta.szlcsc.com/upload/public/pdf/source/20191011/C393941_0DDD896EE907FEB750D8B7B8982E2A67.pdf; Supplier: LCSC; Convert to PCB: yes; Contact Material: -; Contact Plating: -; Operating Temperature Range: -20℃~+90℃; Soldering Temperature(Max): -; Supplementary Features: -; Comment_1: TF PUSH
J4 = TYPE-C 16PIN 2MD(073): Manufacturer: SHOU HAN(首韩); Add into BOM: yes; Gender: 母; Number of Contacts: 16P; Number of Ports: 1; Current Rating - Power (Max): 5A; Rated Voltage (Max): 5V; Connect-Disconnect Life: 5千次; Core Colour: 黑色; Symbol: TYPE-C 16PIN 2MD(073); Device: TYPE-C 16PIN 2MD(073); LCSC Part Name: Type-C 母 卧贴; Supplier Part: C2765186; Manufacturer Part: TYPE-C 16PIN 2MD(073); Supplier Footprint: SMD; JLCPCB Part Class: Extended Part; Datasheet: https://atta.szlcsc.com/upload/public/pdf/source/20211123/39B17C16241EAC15C5E277BDA434118E.pdf; Supplier: LCSC; Convert to PCB: yes; Connector Type: Type-C; Standard: USB 3.1; Mounting Style: 卧贴; Operating Temperature Range: -25℃~+85℃; Comment_1: TYPE-C 16PIN 2MD(073)
J14 = HEADER 5X2
P2 = Header 3: Header, 3-Pin; LatestRevisionDate: 17-Jul-2002; LatestRevisionNote: Re-released for DXP Platform.; Publisher: Altium Limited
R307 R310 R312 R314 R327 R328 R330 R332 R632 = RES_Dup2: AC0402FR-070RL/YAGEO; Part Reference: R97; CLASS: DISCRETE; SIGNAL_MODEL: DEFAULT_RESISTOR_33.000000OHM_2_1; FPLIST: RC0603_OV; CAD_APPROVED: Yes; MFG_PN01: CR-02FL6---33R; MFG_NAME01: YAGEO; Tolerance: 1%; AGILE_PN: 470-75790; TOL: 5%; ROHS: Yes; HEIGHT: 0.4MM; PCB Footprint: R0402
R308 = Res Semi: Semiconductor Resistor; Value: 1K; Published: 8-Jun-2000; LatestRevisionDate: 17-Jul-2002; LatestRevisionNote: Re-released for DXP Platform.; PackageReference: AXIAL-0.5; Publisher: Altium Limited; PackageDescription: Axial Device, Thru-Hole; 2 Leads; 0.5 in Pin Spacing
R309 R311 R316-R323 R329 R331 R333-R337 R628-R631 = RES_Dup2: AC0402FR-0710KL/YAGEO; Part Reference: R94; CLASS: DISCRETE; PCB Footprint: R0402
R313 R315 = RES_Dup2: AC0402FR-070RL/YAGEO; Part Reference: R98; CLASS: DISCRETE; TOL: 5%; AGILE_PN: 470-75790; Tolerance: 1%; MFG_NAME01: YAGEO; MFG_PN01: CR-02FL6---33R; CAD_APPROVED: Yes; FPLIST: RC0603_OV; SIGNAL_MODEL: DEFAULT_RESISTOR_33.000000OHM_2_1; HEIGHT: 0.4MM; ROHS: Yes; PCB Footprint: R0402
R324 R325 = RES_Dup1: RES MF 1.0K 1/16W 5% 0402; CLASS: DISCRETE; AGILE_PN: 470-75555; MFG_NAME01: VISHAY INTERTECHNOLOGY; MFG_PN01: CRCW04021K00JNED; CAD_APPROVED: Yes; FPLIST: RC0402_25,RC0402_HD,RC0402_CC; HEIGHT: 0.41mm; TOL: 5%; Tolerance: 5%; ROHS: Yes
R338 = R_Dup3: Part Reference: R130; PCB Footprint: R0402
R339 = R_Dup3: Part Reference: R131; PCB Footprint: R0402
U6 = ESP32-S3-WROOM-2-N32R8V: Manufacturer: ESPRESSIF(乐鑫); Add into BOM: yes; Core Processor: ESP32-S3R8V芯片; Support Interface: I2C；GPIO；SPI；PWM；ADC；UART；USB；I2S; Value: 2.4GHz; Output Power: 20.5dBm; Symbol: ESP32-S3-WROOM-2-N32R8V; Device: ESP32-S3-WROOM-2-N32R8V; LCSC Part Name: ESP32-S3-WROOM-2-N32R8V; Supplier Part: C3021270; Manufacturer Part: ESP32-S3-WROOM-2-N32R8V; Supplier Footprint: SMD-41P; JLCPCB Part Class: Extended Part; Datasheet: https://atta.szlcsc.com/upload/public/pdf/source/20240130/C1D348304CAAF72A05B43D2BF874139A.pdf; Supplier: LCSC; Convert to PCB: yes; Comment_1: 2.4GHz
U7 = W5500: Manufacturer: WIZNET; Add into BOM: yes; channel: 8; IO Type: SPI; Supply Voltage: 3.3V; Supply Current: 132mA; Symbol: W5500; Device: W5500; LCSC Part Name: 硬连线TCP/IP嵌入式以太网控制器; Supplier Part: C32843; Manufacturer Part: W5500; Supplier Footprint: LQFP-48(7x7); JLCPCB Part Class: Extended Part; Datasheet: https://atta.szlcsc.com/upload/public/pdf/source/20230714/E10C32B058E0BA54FCE1C1556BE10C07.pdf; Supplier: LCSC; Convert to PCB: yes; Operating Temperature  range: -40℃~+85℃; Comment_1: W5500